# EAGLE design nixie_v5 (EAGLE 9.0.0)
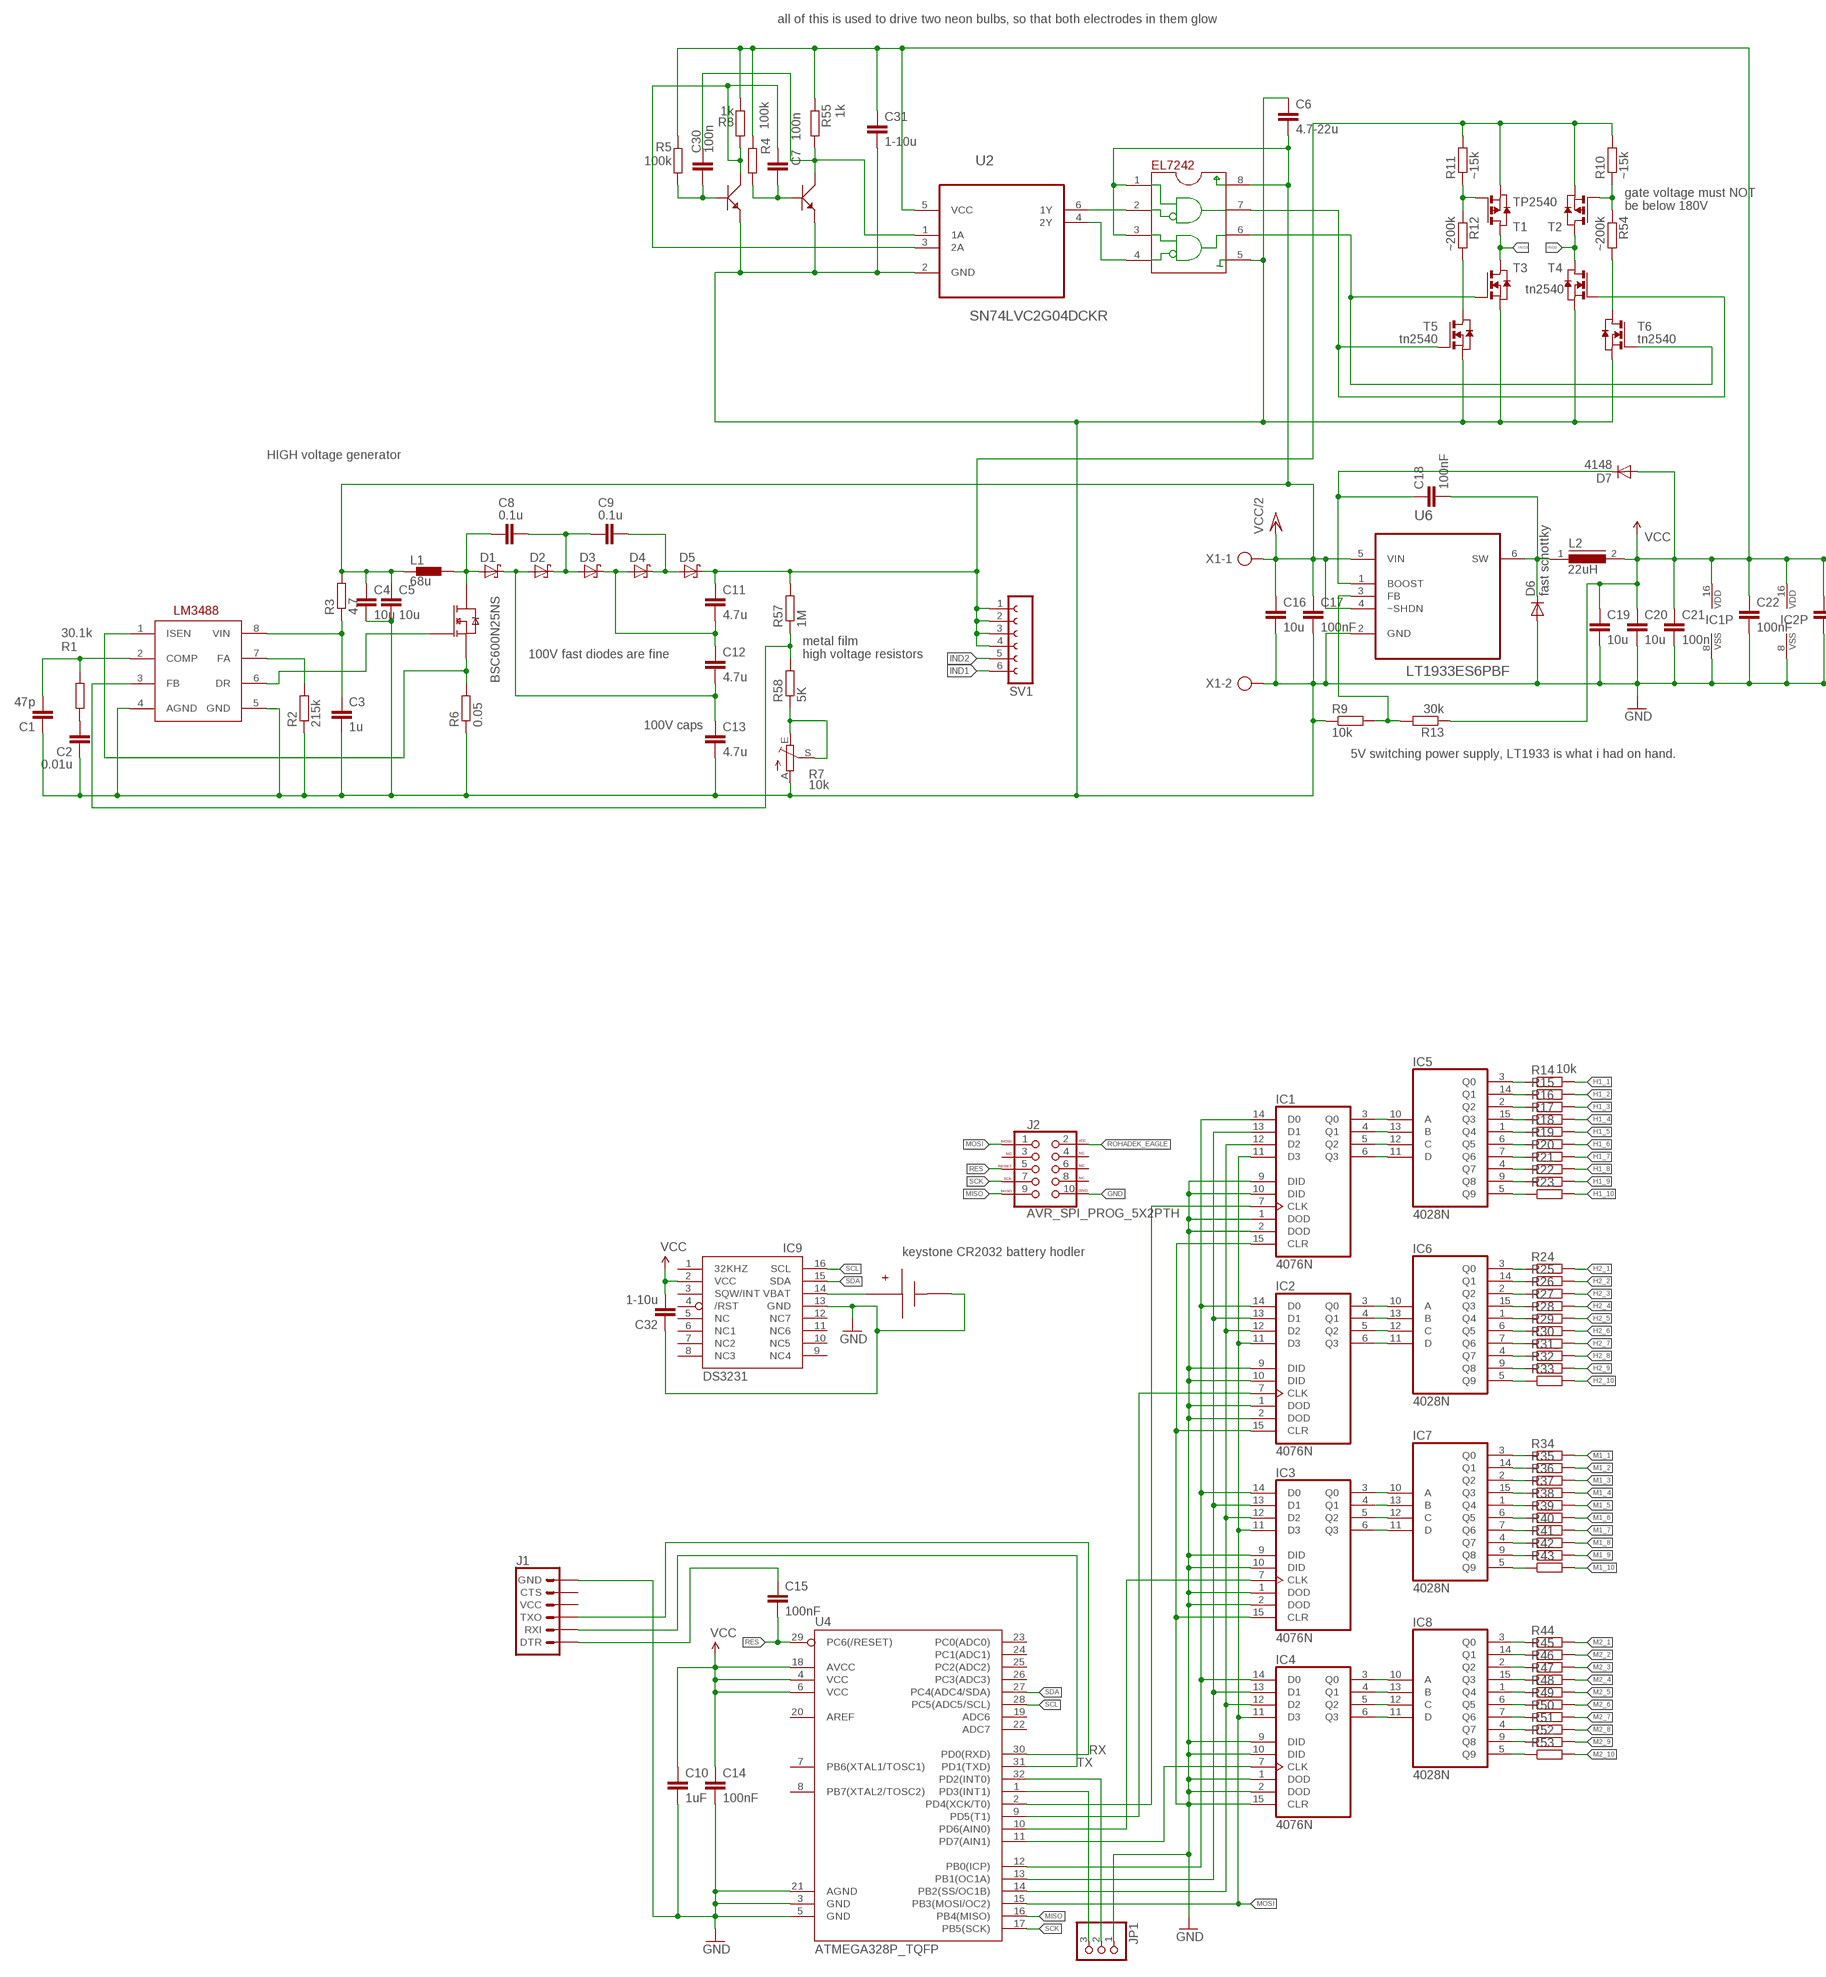
[diagram p0: schematic, sheet 1, part 1 of 2]
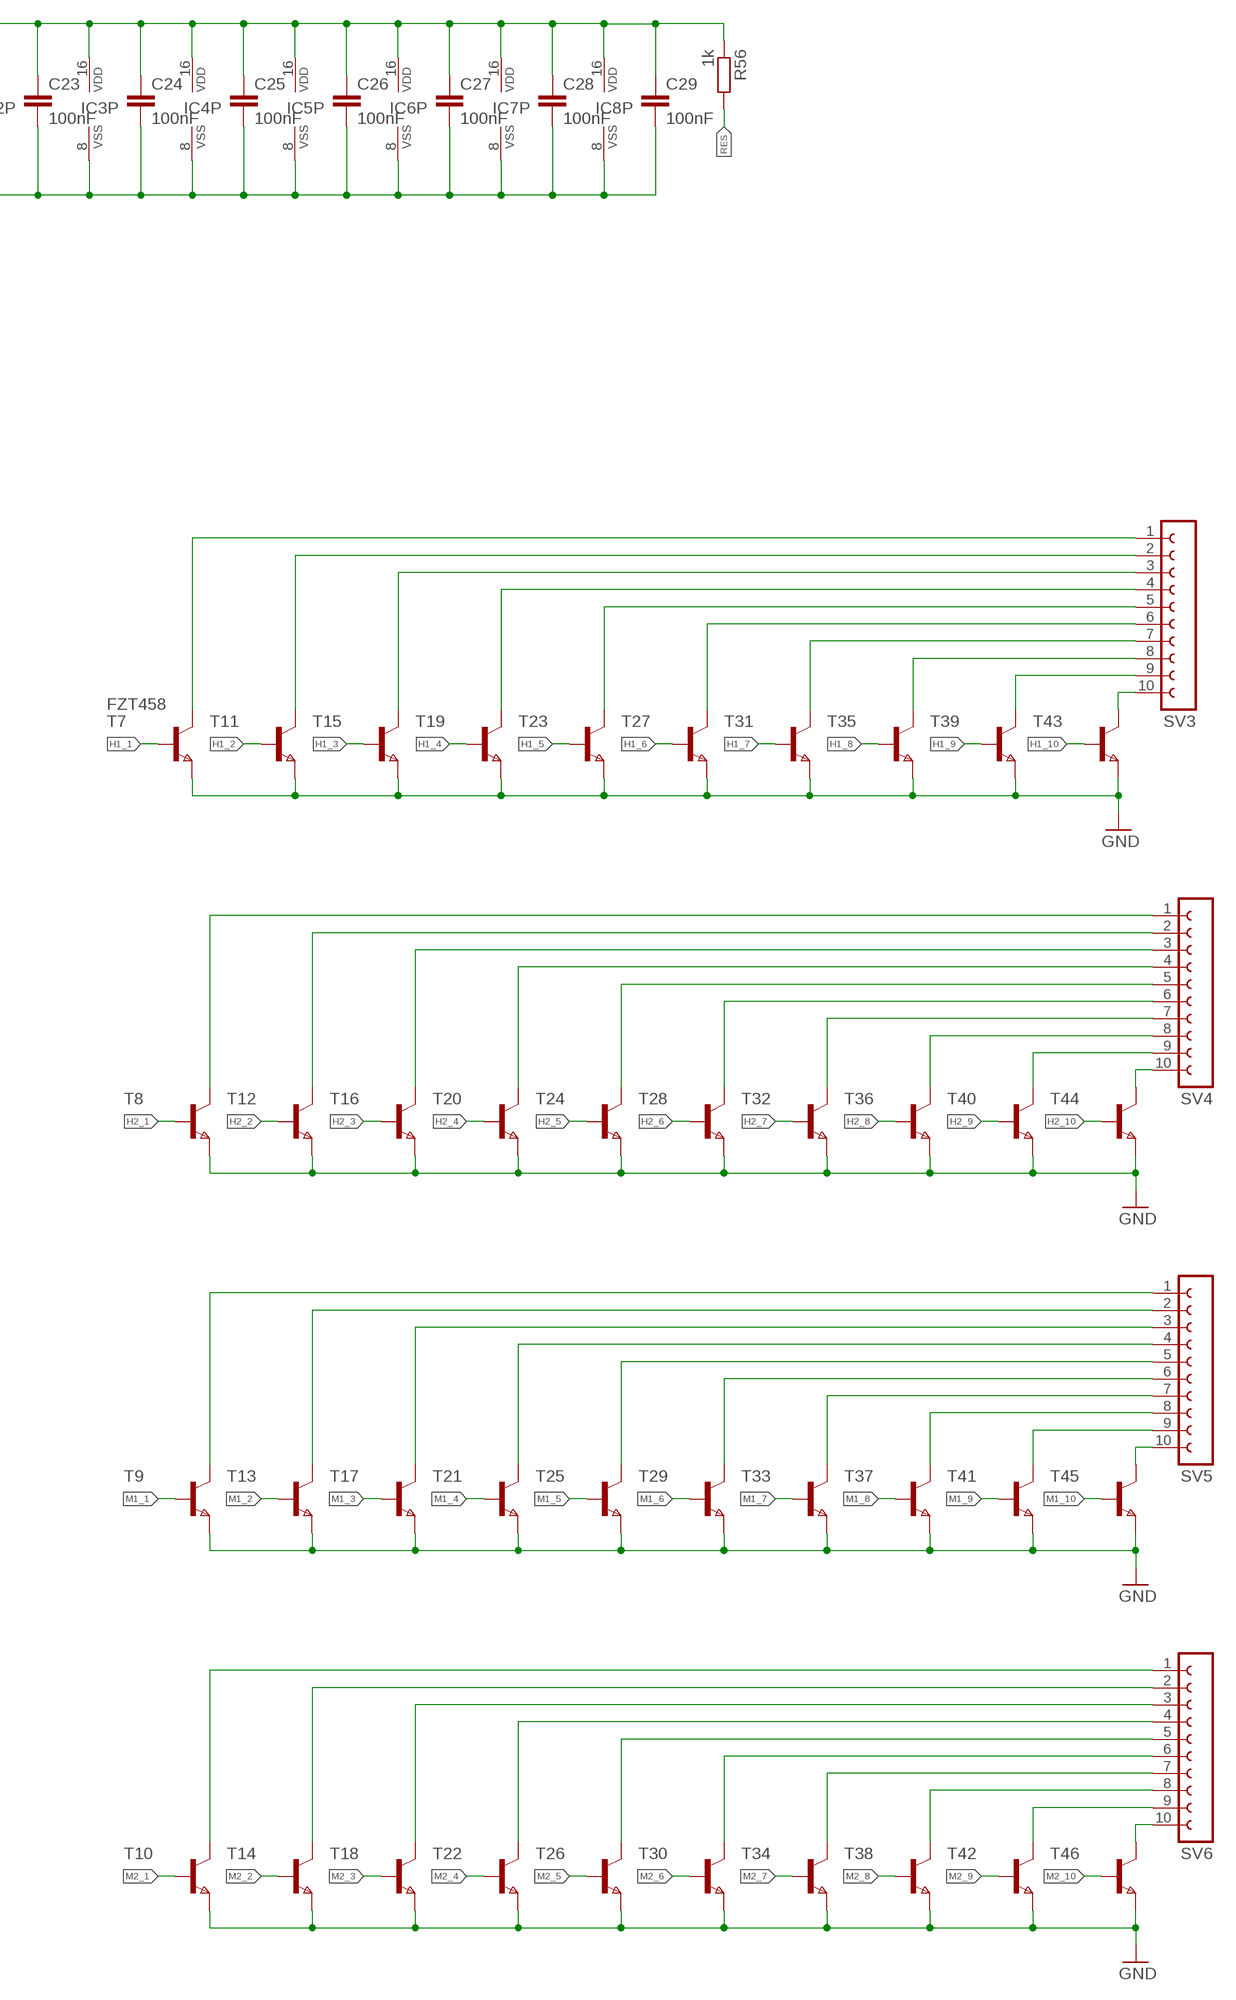
[diagram p1: schematic, sheet 1, part 2 of 2]

## Parts
BSC600N25NS  BSC600N25NS  PGTDSON  [PGTDSON]
C1  47p  C-EUC0402  [C0402]
C2  0.01u  C-EUC0402  [C0402]
C3  1u  C-EUC0805  [C0805]
C4  10u  C-EUC1206  [C1206]
C5  10u  C-EUC1206  [C1206]
C6  4.7-22u  C-EUC1206  [C1206]
C7  100n  C-EUC0402  [C0402]
C8  0.1u  C-EUC0805  [C0805]
C9  0.1u  C-EUC0805  [C0805]
C10  1uF  C-EUC0402  [C0402]
C11  4.7u  C-EUC2220K  [C2220K]
C12  4.7u  C-EUC2220K  [C2220K]
C13  4.7u  C-EUC2220K  [C2220K]
C14  100nF  C-EUC0402  [C0402]
C15  100nF  C-EUC0402  [C0402]
C16  10u  C-EUC1206  [C1206]
C17  100nF  C-EUC0805K  [C0805K]
C18  100nF  C-EUC0805K  [C0805K]
C19  10u  C-EUC1206  [C1206]
C20  10u  C-EUC1206  [C1206]
C21  100n  C-EUC0805K  [C0805K]
C22  100nF  C-EUC0805  [C0805]
C23  100nF  C-EUC0805  [C0805]
C24  100nF  C-EUC0805  [C0805]
C25  100nF  C-EUC0805  [C0805]
C26  100nF  C-EUC0805  [C0805]
C27  100nF  C-EUC0805  [C0805]
C28  100nF  C-EUC0805  [C0805]
C29  100nF  C-EUC0805  [C0805]
C30  100n  C-EUC0402  [C0402]
C31  1-10u  C-EUC0805  [C0805]
C32  1-10u  C-EUC0805  [C0805]
D1  SCHOTTKY-DIODE  [POWERDI123]
D2  SCHOTTKY-DIODE  [POWERDI123]
D3  SCHOTTKY-DIODE  [POWERDI123]
D4  SCHOTTKY-DIODE  [POWERDI123]
D5  SCHOTTKY-DIODE  [POWERDI123]
D6  fast schottky  DIODE-SOD123  [SOD123]
D7  4148  DIODE-SOD123  [SOD123]
EL7242  EL7242  [EL7242]
IC1  4076N  [DIL16]
IC2  4076N  [DIL16]
IC3  4076N  [DIL16]
IC4  4076N  [DIL16]
IC5  4028N  [DIL16]
IC6  4028N  [DIL16]
IC7  4028N  [DIL16]
IC8  4028N  [DIL16]
IC9  DS3231/SO  [SO16W]
J1  6_PIN_SERIAL_TARGETLOCK  [1X06_LOCK]
J2  AVR_SPI_PROG_5X2PTH  [2X5]
JP1  PINHD-1X3CB  [1X03-CLEANBIG]
L1  68u  DR1030  [DR1030]
L2  22uH  DR74  [DR74]
R1  30.1k  R-EU_R0402  [R0402]
R2  215k  R-EU_R0402  [R0402]
R3  4.7  R-EU_R0805  [R0805]
R4  100k  R-EU_R0402  [R0402]
R5  100k  R-EU_R0402  [R0402]
R6  0.05  R-EU_R2512  [R2512]
R7  10k  TRIM_EU-S64Y  [S64Y]
R8  1k  R-EU_R0402  [R0402]
R9  10k  R-EU_M0805  [M0805]
R10  ~15k  R-EU_M0805  [M0805]
R11  ~15k  R-EU_M0805  [M0805]
R12  ~200k  R-EU_M0805  [M0805]
R13  30k  R-EU_M0805  [M0805]
R14  10k  R-EU_M1206  [M1206]
R15  R-EU_M1206  [M1206]
R16  R-EU_M1206  [M1206]
R17  R-EU_M1206  [M1206]
R18  R-EU_M1206  [M1206]
R19  R-EU_M1206  [M1206]
R20  R-EU_M1206  [M1206]
R21  R-EU_M1206  [M1206]
R22  R-EU_M1206  [M1206]
R23  R-EU_M1206  [M1206]
R24  R-EU_M1206  [M1206]
R25  R-EU_M1206  [M1206]
R26  R-EU_M1206  [M1206]
R27  R-EU_M1206  [M1206]
R28  R-EU_M1206  [M1206]
R29  R-EU_M1206  [M1206]
R30  R-EU_M1206  [M1206]
R31  R-EU_M1206  [M1206]
R32  R-EU_M1206  [M1206]
R33  R-EU_M1206  [M1206]
R34  R-EU_M1206  [M1206]
R35  R-EU_M1206  [M1206]
R36  R-EU_M1206  [M1206]
R37  R-EU_M1206  [M1206]
R38  R-EU_M1206  [M1206]
R39  R-EU_M1206  [M1206]
R40  R-EU_M1206  [M1206]
R41  R-EU_M1206  [M1206]
R42  R-EU_M1206  [M1206]
R43  R-EU_M1206  [M1206]
R44  R-EU_M1206  [M1206]
R45  R-EU_M1206  [M1206]
R46  R-EU_M1206  [M1206]
R47  R-EU_M1206  [M1206]
R48  R-EU_M1206  [M1206]
R49  R-EU_M1206  [M1206]
R50  R-EU_M1206  [M1206]
R51  R-EU_M1206  [M1206]
R52  R-EU_M1206  [M1206]
R53  R-EU_M1206  [M1206]
R54  ~200k  R-EU_M0805  [M0805]
R55  1k  R-EU_R0402  [R0402]
R56  1k  R-EU_R0402  [R0402]
R57  1M  R-EU_R1206  [R1206]
R58  5K  R-EU_R1206  [R1206]
SV1  FE06-1  [FE06]
SV3  FE10-1  [FE10]
SV4  FE10-1  [FE10]
SV5  FE10-1  [FE10]
SV6  FE10-1  [FE10]
T1  TP2540  PMOSSOT89  [SOT89]
T2  tp2540  PMOSSOT89  [SOT89]
T3  tn2540  NMOSSOT89  [SOT89]
T4  tn2540  NMOSSOT89  [SOT89]
T5  tn2540  NMOSSOT89  [SOT89]
T6  tn2540  NMOSSOT89  [SOT89]
T7  FZT458  NPNSOT223  [SOT223]
T8  NPNSOT223  [SOT223]
T9  NPNSOT223  [SOT223]
T10  NPNSOT223  [SOT223]
T11  NPNSOT223  [SOT223]
T12  NPNSOT223  [SOT223]
T13  NPNSOT223  [SOT223]
T14  NPNSOT223  [SOT223]
T15  NPNSOT223  [SOT223]
T16  NPNSOT223  [SOT223]
T17  NPNSOT223  [SOT223]
T18  NPNSOT223  [SOT223]
T19  NPNSOT223  [SOT223]
T20  NPNSOT223  [SOT223]
T21  NPNSOT223  [SOT223]
T22  NPNSOT223  [SOT223]
T23  NPNSOT223  [SOT223]
T24  NPNSOT223  [SOT223]
T25  NPNSOT223  [SOT223]
T26  NPNSOT223  [SOT223]
T27  NPNSOT223  [SOT223]
T28  NPNSOT223  [SOT223]
T29  NPNSOT223  [SOT223]
T30  NPNSOT223  [SOT223]
T31  NPNSOT223  [SOT223]
T32  NPNSOT223  [SOT223]
T33  NPNSOT223  [SOT223]
T34  NPNSOT223  [SOT223]
T35  NPNSOT223  [SOT223]
T36  NPNSOT223  [SOT223]
T37  NPNSOT223  [SOT223]
T38  NPNSOT223  [SOT223]
T39  NPNSOT223  [SOT223]
T40  NPNSOT223  [SOT223]
T41  NPNSOT223  [SOT223]
T42  NPNSOT223  [SOT223]
T43  NPNSOT223  [SOT223]
T44  NPNSOT223  [SOT223]
T45  NPNSOT223  [SOT223]
T46  NPNSOT223  [SOT223]
U1  LM3488  [VSSOP-8]
U2  SN74LVC2G04DCKR  [SOT65P210X110-6N]
U4  ATMEGA328P_TQFP  [TQFP32-08]
U6  LT1933ES6PBF  [SOT95P280X145-6N]
U$1  RTC2032  [CR2032]
U$2  DUAL_NPNSC  [SC-70]
X1  AK300/2  [AK300/2]

## Nets
CLK_H1: IC1.7(CLK) U4.2(PD4(XCK/T0))
CLK_H2: IC2.7(CLK) U4.9(PD5(T1))
CLK_M1: IC3.7(CLK) U4.10(PD6(AIN0))
CLK_M2: IC4.7(CLK) U4.11(PD7(AIN1))
D0: IC1.14(D0) IC2.14(D0) IC3.14(D0) IC4.14(D0) U4.12(PB0(ICP))
D1: IC1.13(D1) IC2.13(D1) IC3.13(D1) IC4.13(D1) U4.13(PB1(OC1A))
D2: IC1.12(D2) IC2.12(D2) IC3.12(D2) IC4.12(D2) U4.14(PB2(SS/OC1B))
GND: C1.1 C2.2 C3.2 C4.2 C5.2 C6.1 C10.2 C13.2 C14.2 C16.2 C17.2 C19.2 C20.2 C21.2 C22.2 C23.2 C24.2 C25.2 C26.2 C27.2 C28.2 C29.2 C31.2 C32.1 D6.A EL7242.5 IC1.1(DOD) IC1.2(DOD) IC1.8(VSS) IC1.9(DID) IC1.10(DID) IC1.15(CLR) IC2.1(DOD) IC2.2(DOD) IC2.8(VSS) IC2.9(DID) IC2.10(DID) IC2.15(CLR) IC3.1(DOD) IC3.2(DOD) IC3.8(VSS) IC3.9(DID) IC3.10(DID) IC3.15(CLR) IC4.1(DOD) IC4.2(DOD) IC4.8(VSS) IC4.9(DID) IC4.10(DID) IC4.15(CLR) IC5.8(VSS) IC6.8(VSS) IC7.8(VSS) IC8.8(VSS) IC9.13(GND) J1.6(GND) J2.10(GND) JP1.1 R2.1 R6.1 R7.A R9.1 T3.3(S) T4.3(S) T5.3(S) T6.3(S) T7.3(E) T8.3(E) T9.3(E) T10.3(E) T11.3(E) T12.3(E) T13.3(E) T14.3(E) T15.3(E) T16.3(E) T17.3(E) T18.3(E) T19.3(E) T20.3(E) T21.3(E) T22.3(E) T23.3(E) T24.3(E) T25.3(E) T26.3(E) T27.3(E) T28.3(E) T29.3(E) T30.3(E) T31.3(E) T32.3(E) T33.3(E) T34.3(E) T35.3(E) T36.3(E) T37.3(E) T38.3(E) T39.3(E) T40.3(E) T41.3(E) T42.3(E) T43.3(E) T44.3(E) T45.3(E) T46.3(E) U1.4(AGND) U1.5(GND) U2.2(GND) U4.3(GND) U4.5(GND) U4.21(AGND) U6.2(GND) U$1.-(BATT-) U$2.1(EMITTER) U$2.4(EMITTER1) X1.2
H1_1: R14.2 T7.1(B)
H1_2: R15.2 T11.1(B)
H1_3: R16.2 T15.1(B)
H1_4: R17.2 T19.1(B)
H1_5: R18.2 T23.1(B)
H1_6: R19.2 T27.1(B)
H1_7: R20.2 T31.1(B)
H1_8: R21.2 T35.1(B)
H1_9: R22.2 T39.1(B)
H1_10: R23.2 T43.1(B)
H2_1: R24.2 T8.1(B)
H2_2: R25.2 T12.1(B)
H2_3: R26.2 T16.1(B)
H2_4: R27.2 T20.1(B)
H2_5: R28.2 T24.1(B)
H2_6: R29.2 T28.1(B)
H2_7: R30.2 T32.1(B)
H2_8: R31.2 T36.1(B)
H2_9: R32.2 T40.1(B)
H2_10: R33.2 T44.1(B)
INC: JP1.3 U4.1(PD3(INT1))
IND1: SV1.6 T1.2(D) T3.2(D) T3.2@1(D)
IND2: SV1.5 T2.2(D) T4.2(D) T4.2@1(D)
M1_1: R34.2 T9.1(B)
M1_2: R35.2 T13.1(B)
M1_3: R36.2 T17.1(B)
M1_4: R37.2 T21.1(B)
M1_5: R38.2 T25.1(B)
M1_6: R39.2 T29.1(B)
M1_7: R40.2 T33.1(B)
M1_8: R41.2 T37.1(B)
M1_9: R42.2 T41.1(B)
M1_10: R43.2 T45.1(B)
M2_1: R44.2 T10.1(B)
M2_2: R45.2 T14.1(B)
M2_3: R46.2 T18.1(B)
M2_4: R47.2 T22.1(B)
M2_5: R48.2 T26.1(B)
M2_6: R49.2 T30.1(B)
M2_7: R50.2 T34.1(B)
M2_8: R51.2 T38.1(B)
M2_9: R52.2 T42.1(B)
M2_10: R53.2 T46.1(B)
MISO: J2.9(MISO) U4.16(PB4(MISO))
MOSI: IC1.11(D3) IC2.11(D3) IC3.11(D3) IC4.11(D3) J2.1(MOSI) U4.15(PB3(MOSI/OC2))
N$1: IC9.14(VBAT) U$1.+(BATT+)
N$2: R11.1 R12.1 T1.1(G)
N$4: R7.E R7.S R58.1
N$9: IC1.3(Q0) IC5.10(A)
N$10: IC1.6(Q3) IC5.11(D)
N$11: IC1.5(Q2) IC5.12(C)
N$12: IC1.4(Q1) IC5.13(B)
N$13: IC2.3(Q0) IC6.10(A)
N$14: IC2.6(Q3) IC6.11(D)
N$15: IC2.5(Q2) IC6.12(C)
N$16: IC2.4(Q1) IC6.13(B)
N$17: IC3.3(Q0) IC7.10(A)
N$18: IC3.6(Q3) IC7.11(D)
N$19: IC3.5(Q2) IC7.12(C)
N$20: IC3.4(Q1) IC7.13(B)
N$21: IC4.3(Q0) IC8.10(A)
N$22: IC4.6(Q3) IC8.11(D)
N$23: IC4.5(Q2) IC8.12(C)
N$24: IC4.4(Q1) IC8.13(B)
N$25: SV3.1 T7.2(C) T7.4(C)
N$26: SV3.2 T11.2(C) T11.4(C)
N$27: C18.1 D7.C U6.1(BOOST)
N$28: SV3.3 T15.2(C) T15.4(C)
N$29: SV3.4 T19.2(C) T19.4(C)
N$30: SV3.5 T23.2(C) T23.4(C)
N$31: SV3.6 T27.2(C) T27.4(C)
N$32: SV3.7 T31.2(C) T31.4(C)
N$33: SV3.8 T35.2(C) T35.4(C)
N$34: SV3.9 T39.2(C) T39.4(C)
N$35: SV3.10 T43.2(C) T43.4(C)
N$36: C3.1 R3.1 U1.8(VIN)
N$37: IC5.3(Q0) R14.1
N$38: IC5.14(Q1) R15.1
N$39: IC5.2(Q2) R16.1
N$40: IC5.15(Q3) R17.1
N$41: IC5.1(Q4) R18.1
N$42: IC5.6(Q5) R19.1
N$43: IC5.7(Q6) R20.1
N$44: IC5.4(Q7) R21.1
N$45: IC5.9(Q8) R22.1
N$46: IC5.5(Q9) R23.1
N$47: IC6.3(Q0) R24.1
N$48: IC6.14(Q1) R25.1
N$49: IC6.2(Q2) R26.1
N$50: IC6.15(Q3) R27.1
N$51: IC6.1(Q4) R28.1
N$52: IC6.6(Q5) R29.1
N$53: IC6.7(Q6) R30.1
N$54: IC6.4(Q7) R31.1
N$55: IC6.9(Q8) R32.1
N$56: IC6.5(Q9) R33.1
N$57: SV4.1 T8.2(C) T8.4(C)
N$58: SV4.2 T12.2(C) T12.4(C)
N$59: SV4.3 T16.2(C) T16.4(C)
N$60: SV4.4 T20.2(C) T20.4(C)
N$61: SV4.5 T24.2(C) T24.4(C)
N$62: SV4.6 T28.2(C) T28.4(C)
N$63: SV4.7 T32.2(C) T32.4(C)
N$64: SV4.8 T36.2(C) T36.4(C)
N$65: SV4.9 T40.2(C) T40.4(C)
N$66: SV4.10 T44.2(C) T44.4(C)
N$67: IC8.3(Q0) R44.1
N$68: IC8.14(Q1) R45.1
N$69: IC8.2(Q2) R46.1
N$70: IC8.15(Q3) R47.1
N$71: IC8.1(Q4) R48.1
N$72: IC8.6(Q5) R49.1
N$73: IC8.7(Q6) R50.1
N$74: IC8.4(Q7) R51.1
N$75: IC8.9(Q8) R52.1
N$76: IC8.5(Q9) R53.1
N$77: IC7.3(Q0) R34.1
N$78: IC7.14(Q1) R35.1
N$79: IC7.2(Q2) R36.1
N$80: IC7.15(Q3) R37.1
N$81: IC7.1(Q4) R38.1
N$82: IC7.6(Q5) R39.1
N$83: IC7.7(Q6) R40.1
N$84: IC7.4(Q7) R41.1
N$85: IC7.9(Q8) R42.1
N$86: IC7.5(Q9) R43.1
N$89: R9.2 R13.2 U6.3(FB)
N$90: BSC600N25NS.DRAIN C8.2 D1.A L1.2
N$91: R2.2 U1.7(FA)
N$92: BSC600N25NS.GATE U1.6(DR)
N$93: BSC600N25NS.SOURCE BSC600N25NS.SOURCE1(SOURCE) BSC600N25NS.SOURCE3(SOURCE) R6.2 U1.1(ISEN)
N$94: C8.1 C9.2 D2.K(C) D3.A
N$95: C9.1 D4.K(C) D5.A
N$96: C12.2 C13.1 D1.K(C) D2.A
N$97: SV5.1 T9.2(C) T9.4(C)
N$98: SV5.2 T13.2(C) T13.4(C)
N$99: SV5.3 T17.2(C) T17.4(C)
N$100: SV5.4 T21.2(C) T21.4(C)
N$101: SV5.5 T25.2(C) T25.4(C)
N$102: SV5.6 T29.2(C) T29.4(C)
N$103: SV5.7 T33.2(C) T33.4(C)
N$104: SV5.8 T37.2(C) T37.4(C)
N$105: SV5.9 T41.2(C) T41.4(C)
N$106: SV5.10 T45.2(C) T45.4(C)
N$107: SV6.1 T10.2(C) T10.4(C)
N$108: SV6.2 T14.2(C) T14.4(C)
N$109: SV6.3 T18.2(C) T18.4(C)
N$110: SV6.4 T22.2(C) T22.4(C)
N$111: SV6.5 T26.2(C) T26.4(C)
N$112: SV6.6 T30.2(C) T30.4(C)
N$113: SV6.7 T34.2(C) T34.4(C)
N$114: SV6.8 T38.2(C) T38.4(C)
N$115: SV6.9 T42.2(C) T42.4(C)
N$116: SV6.10 T46.2(C) T46.4(C)
N$118: C11.2 C12.1 D3.K(C) D4.A
N$120: C1.2 R1.2 U1.2(COMP)
N$121: R57.1 R58.2 U1.3(FB)
N$123: C2.1 R1.1
N$125: C15.1 J1.1(DTR)
N$136: R10.1 R54.1 T2.1(G)
N$137: EL7242.6 T3.1(G) T6.1(G)
N$138: C30.2 R5.2 U$2.2(BASE)
N$139: C7.2 R4.2 U$2.5(BASE1)
N$140: C7.1 R8.2 U2.3(2A) U$2.6(COLLECTOR)
N$141: R12.2 T5.2(D) T5.2@1(D)
N$142: R54.2 T6.2(D) T6.2@1(D)
N$143: C30.1 R55.2 U2.1(1A) U$2.3(COLLECTOR1)
N$145: EL7242.7 T4.1(G) T5.1(G)
N$148: C11.1 D5.K(C) R10.2 R11.2 R57.2 SV1.1 SV1.2 SV1.3 SV1.4 T1.3(S) T2.3(S)
N$150: EL7242.2 U2.6(1Y)
N$151: EL7242.4 U2.4(2Y)
RES: C15.2 J2.5(RESET) R56.2 U4.29(PC6(/RESET))
ROHADEK_EAGLE: J2.2(VCC)
RX: J1.3(TXO) U4.30(PD0(RXD))
SCK: J2.7(SCK) U4.17(PB5(SCK))
SCL: IC9.16(SCL) U4.28(PC5(ADC5/SCL))
SDA: IC9.15(SDA) U4.27(PC4(ADC4/SDA))
SET: JP1.2 U4.32(PD2(INT0))
SW: C18.2 D6.C L2.1 U6.6(SW)
TX: J1.2(RXI) U4.31(PD1(TXD))
VCC: C10.1 C14.1 C19.1 C20.1 C21.1 C22.1 C23.1 C24.1 C25.1 C26.1 C27.1 C28.1 C29.1 C31.1 C32.2 D7.A IC1.16(VDD) IC2.16(VDD) IC3.16(VDD) IC4.16(VDD) IC5.16(VDD) IC6.16(VDD) IC7.16(VDD) IC8.16(VDD) IC9.2(VCC) L2.2 R4.1 R5.1 R8.1 R13.1 R55.1 R56.1 U2.5(VCC) U4.4(VCC) U4.6(VCC) U4.18(AVCC)
VCC/2: C4.1 C5.1 C6.2 C16.1 C17.1 EL7242.1 EL7242.3 EL7242.8 L1.1 R3.2 U6.4(~SHDN) U6.5(VIN) X1.1
Unconnected: IC9.1(32KHZ) IC9.3(SQW/INT) IC9.4(/RST) IC9.5(NC) IC9.6(NC1) IC9.7(NC2) IC9.8(NC3) IC9.9(NC4) IC9.10(NC5) IC9.11(NC6) IC9.12(NC7) J1.4(VCC) J1.5(CTS) J2.3(NC) U4.7(PB6(XTAL1/TOSC1)) U4.8(PB7(XTAL2/TOSC2)) U4.19(ADC6) U4.20(AREF) U4.22(ADC7) U4.23(PC0(ADC0)) U4.24(PC1(ADC1)) U4.25(PC2(ADC2)) U4.26(PC3(ADC3))

## Notes on the sheet
- all of this is used to drive two neon bulbs, so that both electrodes in them glow
- gate voltage must NOT 
  be below 180V
- HIGH voltage generator
- BSC600N25NS
- 100V fast diodes are fine
- metal film 
  high voltage resistors
- 100V caps
- 5V switching power supply, LT1933 is what i had on hand.
- keystone CR2032 battery hodler

## Power pins joined to a net without a drawn wire
NC: J2.4(NC) J2.6(NC) J2.8(NC)

## Library data of the parts
BSC600N25NS = PG-TDSON-8:PGTDSON: 600N25NS3G N-channel PG-TDSON-8 250V
C1-C29 = rcl:C-EU: CAPACITOR, European symbol
C30-C32 = rcl:C-EU: CAPACITOR, European symbol; SPICEPREFIX: C
D1-D5 = diode:SCHOTTKY-DIODE: Schottky Diode
D6 D7 = diode:DIODE-: DIODE
EL7242 = EL7242:EL7242: élantec EL7242 MOSFET driver 10Mhz 3V 5V input compatible 20ns delay time 2A peak drive VCC= 4.5V-16V SOIC Pcase 570mW
IC1-IC4 = 40xx:4076: Quad D-type REGISTER
IC5-IC8 = 40xx:4028: BCD to decimal DECODER
IC9 = adafruit:DS3231
J1 = SparkFun-Connectors:6_PIN_SERIAL_TARGET: 6-pin header connection for use with the "FTDI BASIC" pinout - TARGET SIDE. Also known as "Arduino Serial Program Header". It is used to mate with our FTDI Basic serial programmers using the Arduino IDE. Note, this device has "TARGET" in the name. It is intended to be used on a design that contains a target micro-controller that you wish to program. The "sister" device, named "CABLE" is inteneded to be used on a design that usually lives on the end of your USB cable and prvides the converter chip (FTDI232 or FTDI231x) to commnicate serial RX/TX. You can populate with some of these: Break Away Headers - Straight <https://www.sparkfun.com/products/116> (PRT-00116) For reference (or to suit your programming needs) check out these designs: SparkFun FTDI Basic Breakout - 5V <https://www.sparkfun.com/products/9716> (DEV-09716) SparkFun FTDI Basic Breakout - 3.3V <https://www.sparkfun.com/products/9873> (DEV-09873) SparkFun FTDI SmartBasic <https://www.sparkfun.com/products/12935> (DEV-12935) SparkFun Beefy 3 - FTDI Basic Breakout <https://www.sparkfun.com/products/13746> (DEV-13746)
J2 = SparkFun-Connectors:AVR_SPI_PROG_5X2: AVR 10-pin ICSP Header This is the standard AVR In Circuit Serial Programming header. Minimal, but includes pin one indicator. Works with standard Olimex programmers. SparkFun Products: 2x5 AVR ICSP Male Header <https://www.sparkfun.com/products/778> - PTH 2x5 Pin Shrouded Header <https://www.sparkfun.com/products/8506> - PTH2
JP1 = adafruit:PINHD-1X3: PIN HEADER
L1 = inductors:DR1030: DR1030 Series Low Profile Power Inductors Source: Data sheet <http://www.cooperbussmann.com/pdf/c73e479f-f867-4c64-ae26-9c1f23814163.pdf>
L2 = inductors:DR74: High Power Density, High Efficiency, Shielded Inductors Source: coiltronics_dr_series.pdf
R1-R3 R6 R10-R12 R14-R54 R56-R58 = rcl:R-EU_: RESISTOR, European symbol
R4 R5 R8 R55 = rcl:R-EU_: RESISTOR, European symbol; SPICEPREFIX: R
R7 = pot:TRIM_EU-: POTENTIOMETER
R9 R13 = resistor:R-EU_: RESISTOR, European symbol
SV1 = con-lsta:FE06-1: FEMALE HEADER; OC_FARNELL: unknown; OC_NEWARK: unknown
SV3-SV6 = con-lsta:FE10-1: FEMALE HEADER; OC_FARNELL: unknown; OC_NEWARK: unknown
T1 T2 = zetex:PMOSSOT89: MOS FET; OC_FARNELL: unknown; OC_NEWARK: unknown
T3-T6 = zetex:NMOSSOT89: MOS FET; OC_FARNELL: unknown; OC_NEWARK: unknown
T7-T46 = zetex:NPNSOT223: NPN TRANSISTOR; MPN: DJT4031N-13; OC_FARNELL: 1710672; OC_NEWARK: 25R4490
U1 = texas:LM3488: LM3488 DC-DC converter
U2 = Texas Instruments_By_element14_Batch_1:SN74LVC2G04DCKR: DUAL INVERTER GATE; MPN: SN74LVC2G04DCKR; OC_FARNELL: 1470882; OC_NEWARK: 76C4192; PACKAGE: SC70-6; SUPPLIER: Texas Instruments
U4 = SparkFun-IC-Microcontroller:ATMEGA328P_TQFP: Popular 328P in QFP Storefront component: ATmega328 - TQFP <https://www.sparkfun.com/products/13448> (COM-13448) Datasheet <http://www.sparkfun.com/datasheets/Components/SMD/ATMega328.pdf> SparkFun Products SparkFun RedBoard - Programmed with Arduino <https://www.sparkfun.com/products/12757> (DEV-12757) Arduino Pro Mini 328 - 5V/16MHz <https://www.sparkfun.com/products/11113> (DEV-11113) Arduino Pro Mini 328 - 3.3V/8MHz <https://www.sparkfun.com/products/11114> (DEV-11114) SparkFun OpenLog <https://www.sparkfun.com/products/13712> (DEV-13712) SparkFun MicroView - OLED Arduino Module <https://www.sparkfun.com/products/12923> (DEV-12923) SparkFun Digital Sandbox <https://www.sparkfun.com/products/12651> (DEV-12651) SparkFun PicoBoard <https://www.sparkfun.com/products/11888> (WIG-11888) Arduino Fio <https://www.sparkfun.com/products/10116> (DEV-10116) LilyPad Arduino 328 Main Board <https://www.sparkfun.com/products/13342> (DEV-13342) SparkFun RedStick <https://www.sparkfun.com/products/13741> (DEV-13741) LilyPad MP3 <https://www.sparkfun.com/products/11013> (DEV-11013) LilyPad Arduino SimpleSnap <https://www.sparkfun.com/products/10941> (DEV-10941) SparkFun Stepoko <https://www.sparkfun.com/products/13899> (ROB-13899) SparkFun Geiger Counter <https://www.sparkfun.com/products/11345> (SEN-11345) SparkFun EL Sequencer <https://www.sparkfun.com/products/12781> (COM-12781) Arduino Pro 328 - 5V/16MHz <https://www.sparkfun.com/products/10915> (DEV-10915) CryptoCape <https://www.sparkfun.com/products/12773> (DEV-12773) SparkFun IR Thermometer Evaluation Board - MLX90614 <https://www.sparkfun.com/products/10740> (SEN-10740) SparkFun RedBot Mainboard <https://www.sparkfun.com/products/12097> (ROB-12097) Arduino Pro 328 - 3.3V/8MHz <https://www.sparkfun.com/products/10914> (DEV-10914) SparkFun Block for Intel® Edison - Arduino <https://www.sparkfun.com/products/13036> (DEV-13036) SparkFun Simon Says - Surface Mount Soldering Kit <https://www.sparkfun.com/products/10935> (KIT-10935) SparkFun 7-Segment Serial Display - Red <https://www.sparkfun.com/products/11441> (COM-11441) SparkFun 7-Segment Serial Display - White <https://www.sparkfun.com/products/11629> (COM-11629) SparkFun 7-Segment Serial Display - Yellow <https://www.sparkfun.com/products/11443> (COM-11443) SparkFun 7-Segment Serial Display - Kelly Green <https://www.sparkfun.com/products/11440> (COM-11440) SparkFun 7-Segment Serial Display - Blue <https://www.sparkfun.com/products/11442> (COM-11442) SparkFun OpenSegment Serial Display - 20mm (Blue) <https://www.sparkfun.com/products/11647> (COM-11647) SparkFun OpenSegment Serial Display - 20mm (Green) <https://www.sparkfun.com/products/11646> (COM-11646) SparkFun OpenSegment Serial Display - 20mm (White) <https://www.sparkfun.com/products/11648> (COM-11648) SparkFun OpenSegment Serial Display - 20mm (Red) <https://www.sparkfun.com/products/11644> (COM-11644) SparkFun OpenSegment Serial Display - 20mm (Yellow) <https://www.sparkfun.com/products/11645> (COM-11645) SparkFun OpenSegment Shield <https://www.sparkfun.com/products/13190> (DEV-13190); PROD_ID: IC-09069
U6 = LTC_By_element14_Batch_1:LT1933ES6PBF: Step-Down Switching Regulator; MPN: LT1933ES6#PBF; OC_FARNELL: 1531508; OC_NEWARK: 61M3373; PACKAGE: SOT-23-6; SUPPLIER: Linear Technology
U$1 = keystone 500:RTC: coin cell battery holder
U$2 = SparkFun-Retired:DUAL_NPN: dual npn transistor SOT 363 SC 70
X1 = con-ptr500:AK300/2: CONNECTOR; OC_FARNELL: unknown; OC_NEWARK: unknown

## Board
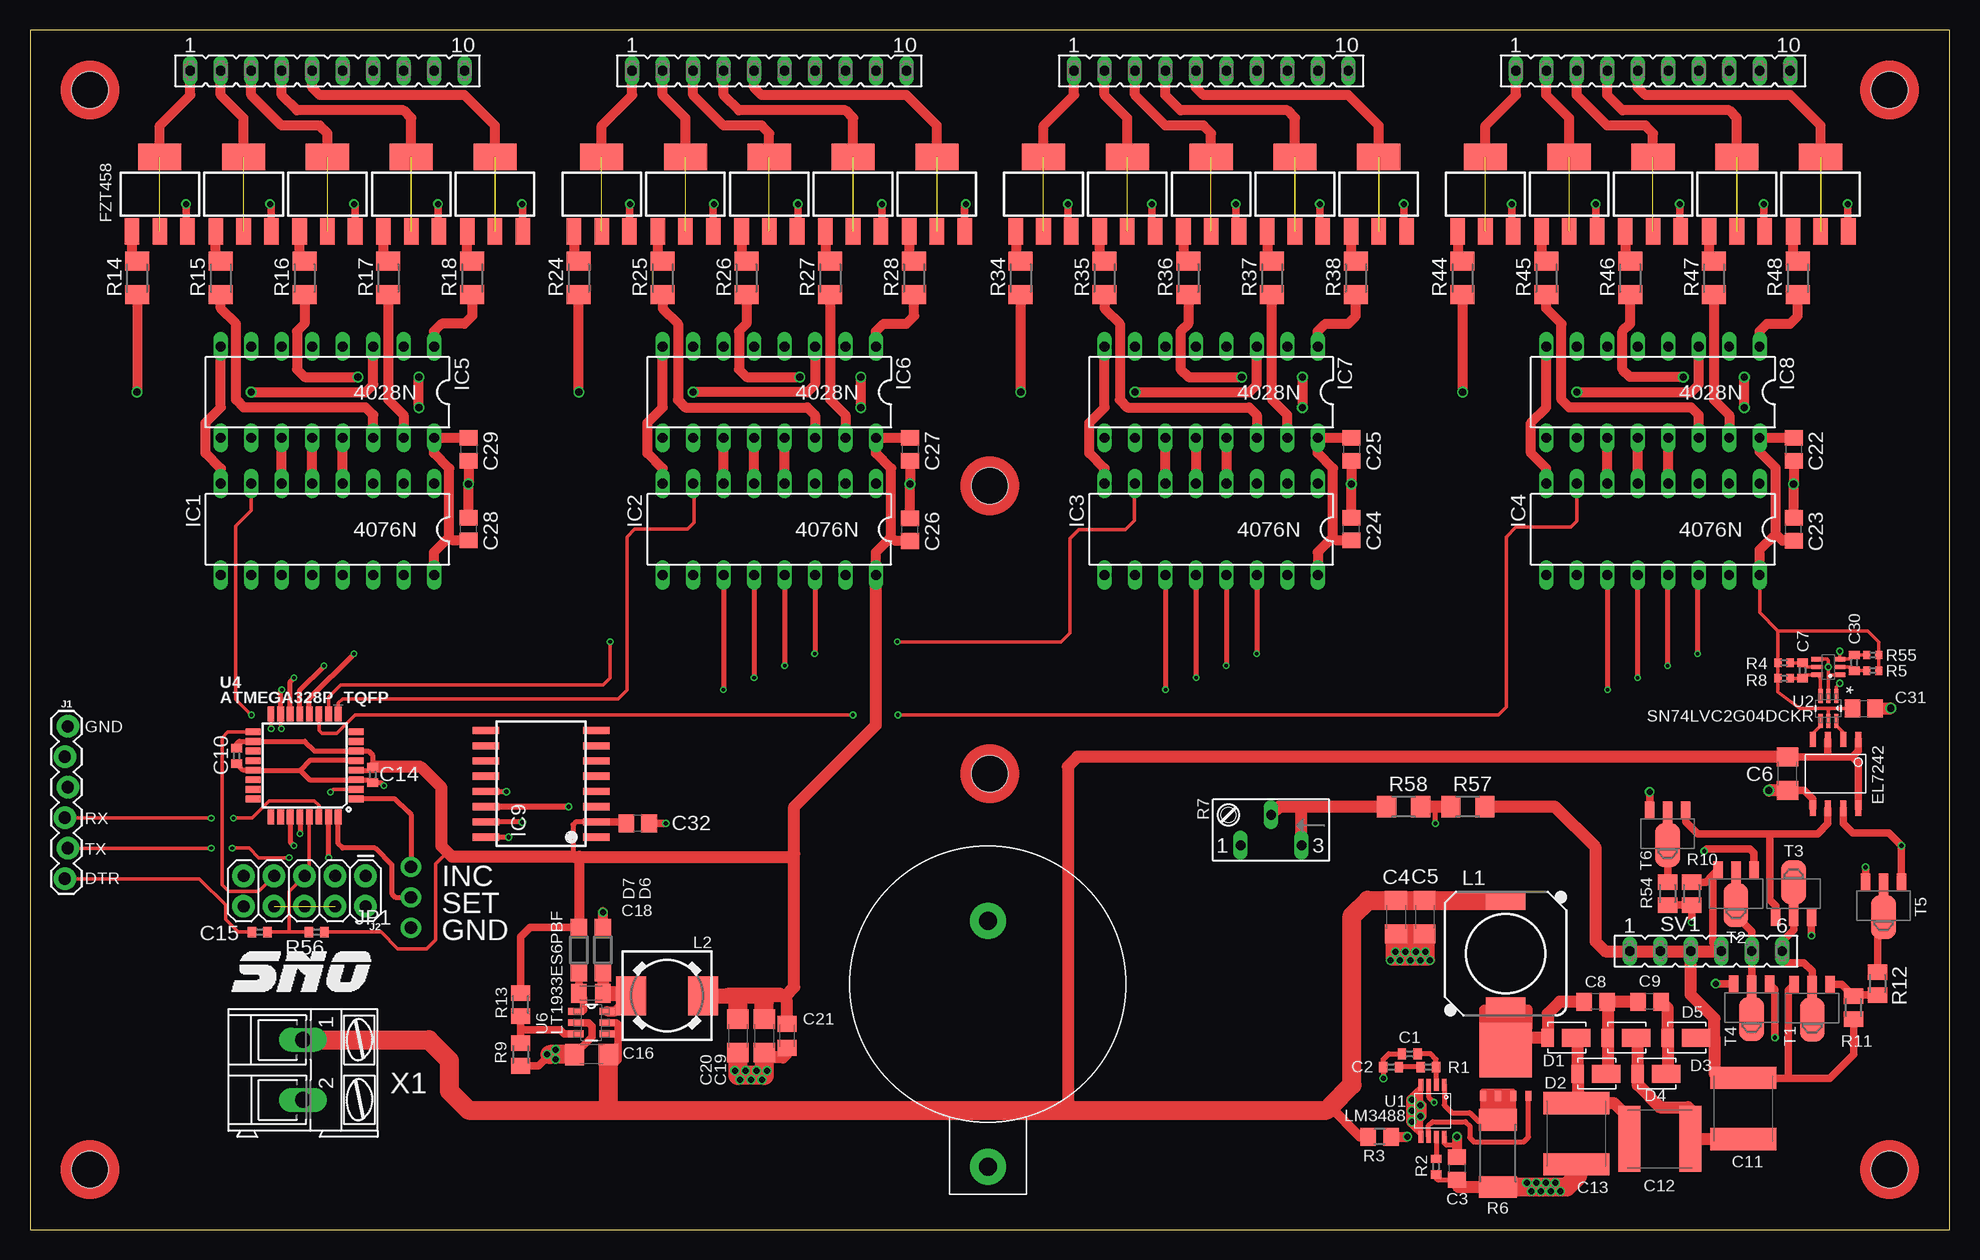
[diagram p2: board, top side]
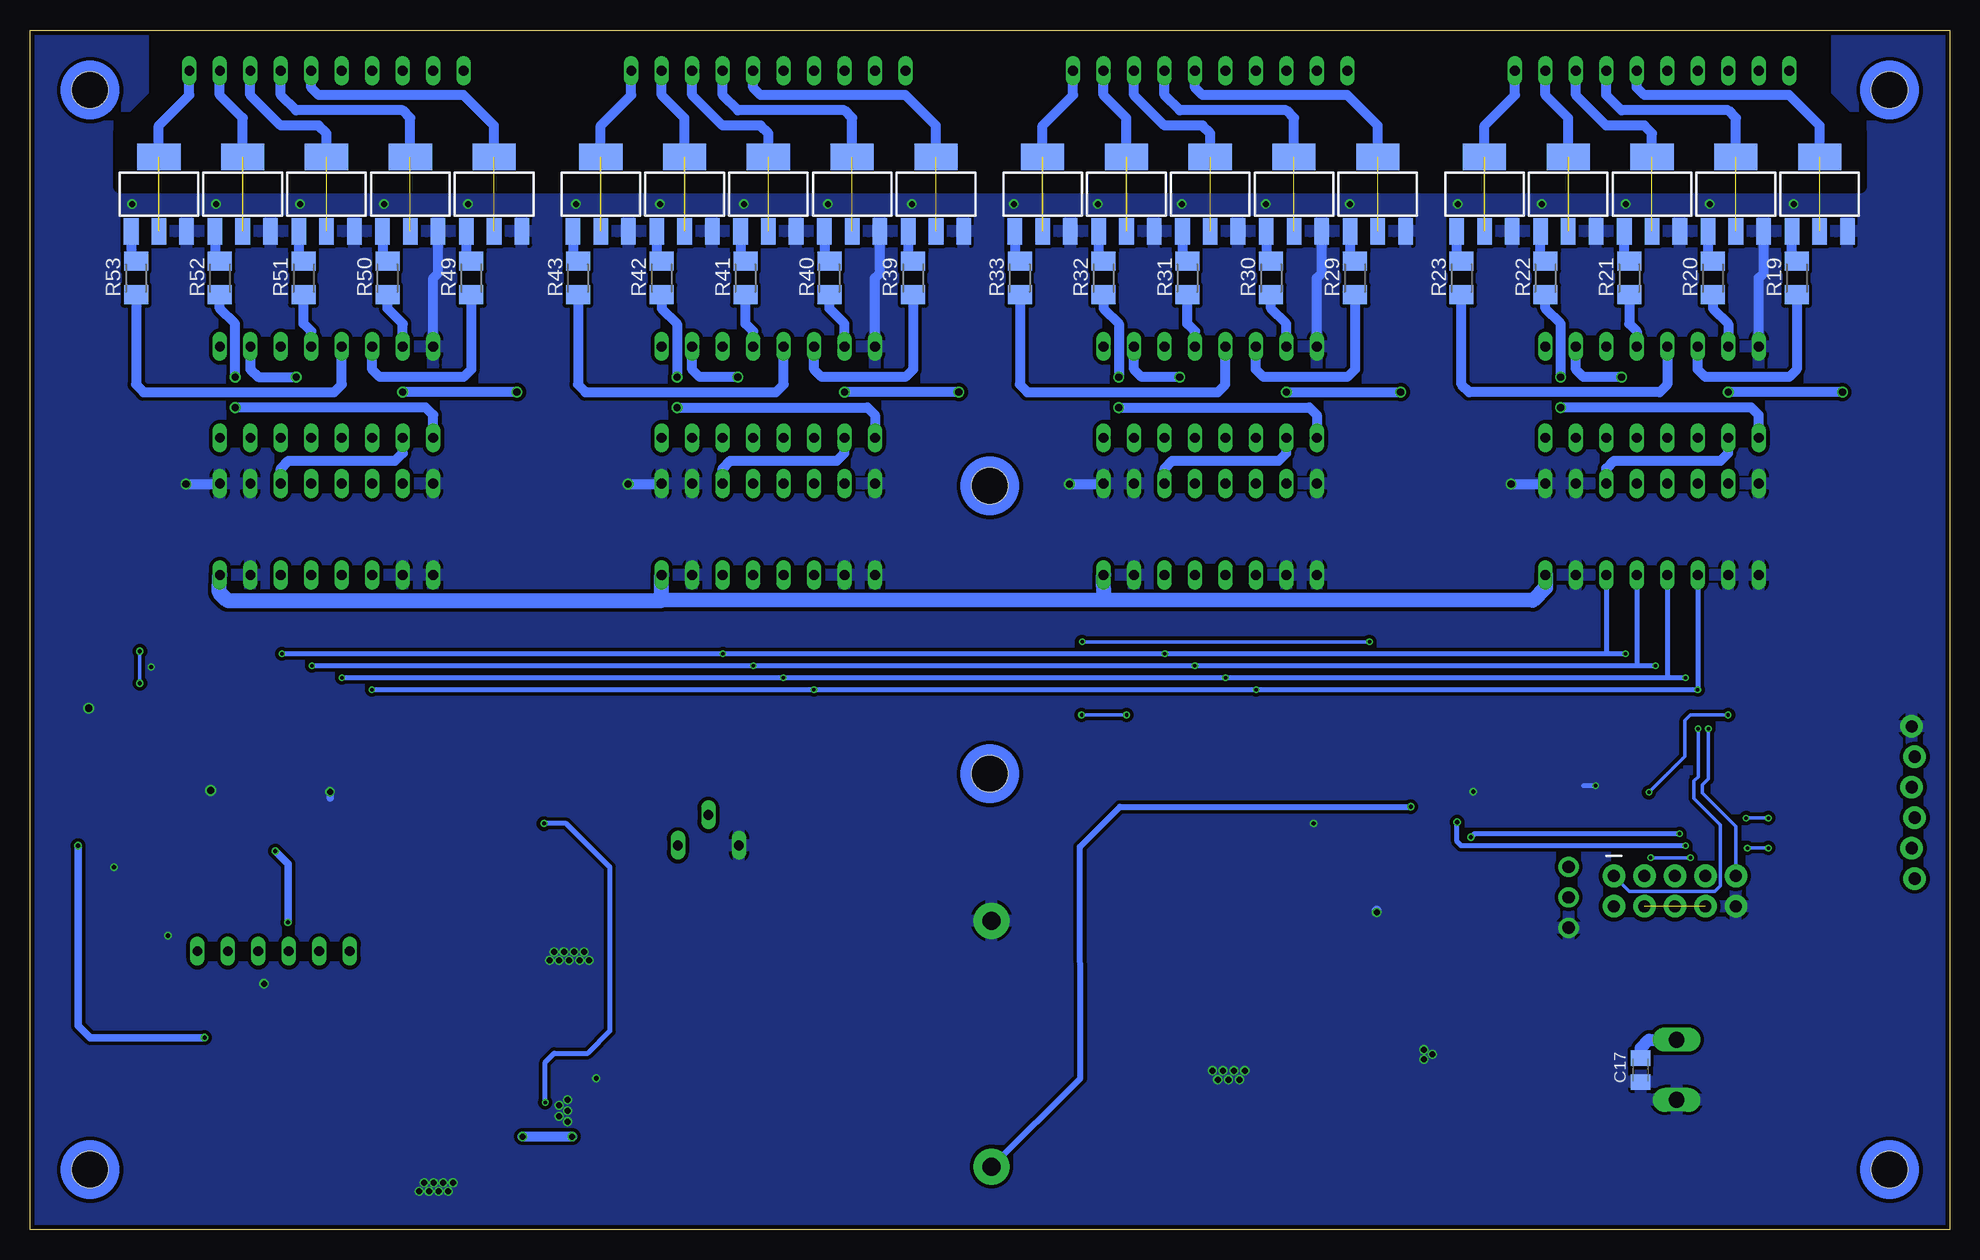
[diagram p3: board, bottom side, seen from below]

Size 160 x 100 mm. Coordinates in mm from the lower left corner, seen from the top.
Outline: 0,0 160,0 160,100 0,100 0,0
Copper layers (1*16): Top 0.035559375mm / dielectric 1.6mm / Bottom 0.035559375mm
Design rules "oshpark-2layer *": minimum track width 6mil, minimum drill 10mil, track to track 6mil, track to pad 6mil, pad to pad 6mil, via to via 6mil, smd to smd 6mil, copper to edge 15mil, drill to drill 6mil, minimum pad ring 5mil, minimum via ring 5mil, stop-mask expansion 2.5mil, vias tented up to drill 40mil, thermal gap 10mil
Holes 3 mm at 155,5 5,5 5,95 155,95 80,62 80,38
bRestrict: 8 lines

### Footprints (pad centres in the part's own frame; a part is rotated, then mirrored left to right if it is on the bottom)
PGTDSON = smd 4.41 x 4.55: DRAIN 0,0.953 | smd 0.5 x 0.85: GATE 1.905,-2.857; SOURCE -1.905,-2.857; SOURCE1 -0.635,-2.857; SOURCE3 0.635,-2.857
C0402 = smd 0.7 x 0.9: 1 -0.65,0; 2 0.65,0
C0805 = smd 1.3 x 1.5: 1 -0.95,0; 2 0.95,0
C1206 = smd 1.6 x 1.8: 1 -1.4,0; 2 1.4,0
C2220K = smd 1.85 x 5.5: 1 -2.55,0; 2 2.55,0
C0805K = smd 1.3 x 1.6: 1 -1,0; 2 1,0
POWERDI123 = smd 1.05 x 1.5: A 0,0 | smd 2.4 x 1.5: K 2.375,0
SOD123 = smd 1.4 x 1.4: A 1.9,0; C -1.9,0
EL7242 = smd 0.508 x 1.27: 1 -1.905,-2.857; 2 -0.635,-2.857; 3 0.635,-2.857; 4 1.905,-2.857; 5 1.905,2.883; 6 0.635,2.883; 7 -0.635,2.883; 8 -1.905,2.883
DIL16 = drill 0.813 long: 1 -8.89,-3.81; 2 -6.35,-3.81; 3 -3.81,-3.81; 4 -1.27,-3.81; 5 1.27,-3.81; 6 3.81,-3.81; 7 6.35,-3.81; 8 8.89,-3.81; 9 8.89,3.81; 10 6.35,3.81; 11 3.81,3.81; 12 1.27,3.81; 13 -1.27,3.81; 14 -3.81,3.81; 15 -6.35,3.81; 16 -8.89,3.81
SO16W = smd 0.6 x 2.2: 1 -4.445,-4.6; 2 -3.175,-4.6; 3 -1.905,-4.6; 4 -0.635,-4.6; 5 0.635,-4.6; 6 1.905,-4.6; 7 3.175,-4.6; 8 4.445,-4.6; 9 4.445,4.6; 10 3.175,4.6; 11 1.905,4.6; 12 0.635,4.6; 13 -0.635,4.6; 14 -1.905,4.6; 15 -3.175,4.6; 16 -4.445,4.6
1X06_LOCK = drill 1.016 pad 1.88: 1 0,0; 2 2.54,-0.254; 3 5.08,0; 4 7.62,-0.254; 5 10.16,0; 6 12.7,-0.254
2X5 = drill 1.016 pad 1.88: 1 0,0; 2 0,2.54; 3 2.54,0; 4 2.54,2.54; 5 5.08,0; 6 5.08,2.54; 7 7.62,0; 8 7.62,2.54; 9 10.16,0; 10 10.16,2.54
1X03-CLEANBIG = drill 1.016 pad 1.676: 1 -2.54,0; 2 0,0; 3 2.54,0
DR1030 = smd 3.3 x 1.6: 1 0,4.45; 2 0,-4.45
DR74 = smd 2.5 x 3.25: 1 -3,0; 2 3,0
R0402 = smd 0.7 x 0.9: 1 -0.65,0; 2 0.65,0
R0805 = smd 1.3 x 1.5: 1 -0.95,0; 2 0.95,0
R0402' = smd 0.6 x 0.7: 1 -0.5,0; 2 0.5,0
R2512 = smd 1.8 x 3.2: 1 -2.8,0; 2 2.8,0
S64Y = drill 0.813 long: A 2.54,1.27; E -2.54,1.27; S 0,-1.27
M0805 = smd 1.3 x 1.6: 1 -0.95,0; 2 0.95,0
M1206 = smd 1.6 x 2: 1 -1.4,0; 2 1.4,0
R1206 = smd 1.6 x 1.803: 1 -1.422,0; 2 1.422,0
FE06 = drill 0.813 long: 1 -6.35,0; 2 -3.81,0; 3 -1.27,0; 4 1.27,0; 5 3.81,0; 6 6.35,0
FE10 = drill 0.813 long: 1 -11.43,0; 2 -8.89,0; 3 -6.35,0; 4 -3.81,0; 5 -1.27,0; 6 1.27,0; 7 3.81,0; 8 6.35,0; 9 8.89,0; 10 11.43,0
SOT89 = smd 0.8 x 1.4: 1 -1.499,-1.981; 3 1.499,-1.981 | smd 0.8 x 1.9: 2 0,-1.727 | smd 2.032 x 3.65: 2@1 0,0.94
SOT223 = smd 1.219 x 2.235: 1 -2.311,-3.099; 2 0,-3.099; 3 2.311,-3.099 | smd 3.6 x 2.2: 4 0,3.099
VSSOP-8 = smd 0.4 x 1: 1 -0.975,-2.15; 2 -0.325,-2.15; 3 0.325,-2.15; 4 0.975,-2.15; 5 0.975,2.15; 6 0.325,2.15; 7 -0.325,2.15; 8 -0.975,2.15
SOT65P210X110-6N = smd 1.168 x 0.356: 1 -1.041,0.66; 2 -1.041,0; 3 -1.041,-0.66; 4 1.041,-0.66; 5 1.041,0; 6 1.041,0.66
TQFP32-08 = smd 1.27 x 0.559: 1 -4.293,2.8; 2 -4.293,2; 3 -4.293,1.2; 4 -4.293,0.4; 5 -4.293,-0.4; 6 -4.293,-1.2; 7 -4.293,-2; 8 -4.293,-2.8; 17 4.293,-2.8; 18 4.293,-2; 19 4.293,-1.2; 20 4.293,-0.4; 21 4.293,0.4; 22 4.293,1.2; 23 4.293,2; 24 4.293,2.8 | smd 0.559 x 1.27: 9 -2.8,-4.293; 10 -2,-4.293; 11 -1.2,-4.293; 12 -0.4,-4.293; 13 0.4,-4.293; 14 1.2,-4.293; 15 2,-4.293; 16 2.8,-4.293; 25 2.8,4.293; 26 2,4.293; 27 1.2,4.293; 28 0.4,4.293; 29 -0.4,4.293; 30 -1.2,4.293; 31 -2,4.293; 32 -2.8,4.293
SOT95P280X145-6N = smd 1.27 x 0.559: 1 -1.295,0.94; 2 -1.295,0; 3 -1.295,-0.94; 4 1.295,-0.94; 5 1.295,0; 6 1.295,0.94
CR2032 = drill 1.5 pad 3: + 0,0; - 0,20.5
SC-70 = smd 0.36 x 0.95: 1 -0.65,-0.95; 2 0,-0.95; 3 0.65,-0.95; 4 0.65,0.95; 5 0,0.95; 6 -0.65,0.95
AK300/2 = drill 1.321 long: 1 -2.515,0; 2 2.489,0

### Placement (x,y rotation side)
BSC600N25NS  123,14 0 top
C1  115,14.65 0 top
C2  113.45,13.55 180 top
C3  118.95,5.1 270 top
C4  113.85,26.05 270 top
C5  116.25,26.05 270 top
C6  146.5,38 90 top
C7  147.75,46.6 90 top
C8  130.5,19 180 top
C9  135,19 180 top
C10  17.22,39.49 270 top
C11  142.8,10.1 270 top
C12  135.85,7.55 180 top
C13  128.9,8 270 top
C14  28.57,37.9 270 top
C15  19.15,24.8 0 top
C16  46.8,14.6 180 top
C17  25.75,13.3 270 bottom
C18  46.75,19.7 0 top
C19  61.2,16.15 270 top
C20  59,16.15 270 top
C21  63.1,16.15 270 top
C22  147,65.05 270 top
C23  147,58.37 90 top
C24  110.15,58.4 90 top
C25  110.15,65.05 270 top
C26  73.35,58.35 90 top
C27  73.35,65.05 270 top
C28  36.55,58.4 90 top
C29  36.55,65.05 270 top
C30  152.05,47.25 270 top
C31  152.85,43.45 0 top
C32  50.65,33.85 180 top
D1  126.5,16 0 top
D2  129,13 0 top
D3  131.5,16 0 top
D4  134,13 0 top
D5  136.5,16 0 top
D6  47.75,23.3 90 top
D7  45.75,23.3 90 top
EL7242  150.5,38 180 top
IC1  24.79,58.37 180 top
IC2  61.62,58.37 180 top
IC3  98.45,58.37 180 top
IC4  135.28,58.37 180 top
IC5  24.79,69.8 180 top
IC6  61.62,69.8 180 top
IC7  98.45,69.8 180 top
IC8  135.28,69.8 180 top
IC9  42.6,37.15 90 top
J1  2.9,29.25 90 top
J2  27.97,29.48 180 top
JP1  31.75,27.7 90 top
L1  123,23 0 top
L2  53.1,19.5 0 top
R1  116.55,13.55 0 top
R2  117.2,5.25 90 top
R3  112.5,7.75 180 top
R4  100k  [R0402']  146.2,47.25 0 top
R5  100k  [R0402']  153.6,46.6 180 top
R6  122.35,6.35 90 top
R7  103.45,33.3 180 top
R8  1k  [R0402']  146.2,45.95 0 top
R9  40.9,14.6 90 top
R10  138.5,28 90 top
R11  152,18.5 270 top
R12  154,20.5 90 top
R13  40.9,18.75 270 top
R14  8.92,79.33 90 top
R15  15.9,79.33 90 top
R16  22.89,79.33 90 top
R17  29.87,79.33 90 top
R18  36.86,79.33 90 top
R19  12.73,79.33 90 bottom
R20  19.71,79.33 90 bottom
R21  26.7,79.33 90 bottom
R22  33.68,79.33 90 bottom
R23  40.67,79.33 90 bottom
R24  45.75,79.33 90 top
R25  52.73,79.33 90 top
R26  59.72,79.33 90 top
R27  66.7,79.33 90 top
R28  73.69,79.33 90 top
R29  49.56,79.33 90 bottom
R30  56.54,79.33 90 bottom
R31  63.53,79.33 90 bottom
R32  70.51,79.33 90 bottom
R33  77.5,79.33 90 bottom
R34  82.58,79.33 90 top
R35  89.56,79.33 90 top
R36  96.55,79.33 90 top
R37  103.53,79.33 90 top
R38  110.52,79.33 90 top
R39  86.39,79.33 90 bottom
R40  93.37,79.33 90 bottom
R41  100.36,79.33 90 bottom
R42  107.34,79.33 90 bottom
R43  114.33,79.33 90 bottom
R44  119.41,79.33 90 top
R45  126.39,79.33 90 top
R46  133.38,79.33 90 top
R47  140.36,79.33 90 top
R48  147.35,79.33 90 top
R49  123.22,79.33 90 bottom
R50  130.2,79.33 90 bottom
R51  137.19,79.33 90 bottom
R52  144.17,79.33 90 bottom
R53  151.16,79.33 90 bottom
R54  136.5,28 90 top
R55  1k  [R0402']  153.6,47.9 180 top
R56  23.9,24.8 180 top
R57  119.85,35.25 0 top
R58  114.5,35.25 0 top
SV1  139.7,23.2 0 top
SV3  24.79,96.6 0 top
SV4  61.62,96.6 0 top
SV5  98.45,96.6 0 top
SV6  135.28,96.6 0 top
T1  148.55,18.45 180 top
T2  142.2,28 180 top
T3  147,28 0 top
T4  143.5,18.5 180 top
T5  154.5,27 180 top
T6  136.5,33 180 top
T7  10.82,86.31 0 top
T8  47.65,86.31 0 top
T9  84.48,86.31 0 top
T10  121.31,86.31 0 top
T11  17.81,86.31 0 top
T12  54.64,86.31 0 top
T13  91.47,86.31 0 top
T14  128.3,86.31 0 top
T15  24.79,86.31 0 top
T16  61.62,86.31 0 top
T17  98.45,86.31 0 top
T18  135.28,86.31 0 top
T19  31.78,86.31 0 top
T20  68.61,86.31 0 top
T21  105.44,86.31 0 top
T22  142.27,86.31 0 top
T23  38.76,86.31 0 top
T24  75.59,86.31 0 top
T25  112.42,86.31 0 top
T26  149.25,86.31 0 top
T27  10.82,86.31 0 bottom
T28  47.65,86.31 0 bottom
T29  84.48,86.31 0 bottom
T30  121.31,86.31 0 bottom
T31  17.81,86.31 0 bottom
T32  54.64,86.31 0 bottom
T33  91.47,86.31 0 bottom
T34  128.3,86.31 0 bottom
T35  24.79,86.31 0 bottom
T36  61.62,86.31 0 bottom
T37  98.45,86.31 0 bottom
T38  135.28,86.31 0 bottom
T39  31.78,86.31 0 bottom
T40  68.61,86.31 0 bottom
T41  105.44,86.31 0 bottom
T42  142.27,86.31 0 bottom
T43  38.76,86.31 0 bottom
T44  75.59,86.31 0 bottom
T45  112.42,86.31 0 bottom
T46  149.25,86.31 0 bottom
U1  116.9,9.9 180 top
U2  149.9,43.45 270 top
U4  22.89,38.69 180 top
U6  46.8,17.25 0 top
U$1  79.85,5.25 0 top
U$2  149.9,46.9 90 top
X1  22.75,13.3 270 top

### Tracks (layer width: path | path; a pad name or v marks a point on that pad's centre or on a via)
CLK_H1  (via drill 0.3)
  Top 0.305: U4.2 25.29,36.69 v25.05,36.45 | v18.45,42.9 17.15,44.2 17.15,58.65 18.45,59.94 IC1.7
  Bottom 0.305: v25.05,36.45 22.05,39.45 22.05,42.45 21.6,42.9 v18.45,42.9
CLK_H2
  Top 0.305: U4.9 25.69,43.89 26.05,44.25 49,44.25 49.75,45 49.75,57.75 50.4,58.4 54.8,58.4 55.35,58.95 55.35,62.11 IC2.7
CLK_M1  (via drill 0.3)
  Top 0.305: U4.10 24.89,44.39 25.9,45.4 47.75,45.4 48.35,46 v48.35,49 | v72.3,49 85.95,49 86.7,49.75 86.7,57.6 87.45,58.35 91.3,58.35 92.05,59.1 92.05,62.13 IC3.7
  Bottom 0.305: v48.35,49 v72.3,49
CLK_M2  (via drill 0.3)
  Top 0.305: U4.11 24.09,41.61 24.35,41.35 25.55,41.35 27.1,42.9 v68.6,42.9 | v72.35,42.9 122.4,42.9 123.05,43.55 123.05,57.75 123.85,58.55 128.45,58.55 128.95,59.05 128.95,62.17 IC4.7
  Bottom 0.305: v68.6,42.9 v72.35,42.9
D0  (via drill 0.3)
  Top 0.406: v139,48 139,54.56 IC4.14 | IC3.14 102.26,48 v102.25,48 | IC2.14 65.43,48 v65.4,48 | U4.12 23.29,44.29 v27,48
  Bottom 0.406: IC1.14 28.61,48 | 28.61,48 v65.4,48 v102.25,48 v139,48 | v27,48 28.61,48
D1  (via drill 0.3)
  Top 0.406: v136.5,47 136.5,54.56 IC4.13 | IC3.13 99.72,47 v99.7,47 | IC2.13 v62.9,47 | U4.13 22.49,44.99 v24.5,47
  Bottom 0.406: IC1.13 26.06,47 | 26.06,47 v62.9,47 v99.7,47 v136.5,47 | v24.5,47 26.06,47
D2  (via drill 0.3)
  Top 0.406: v134,46 IC4.12 | IC3.12 97.18,46 v97.2,46 | IC2.12 v60.35,46 | U4.14 21.69,45.69 v22,46
  Bottom 0.406: IC1.12 23.52,46 | 23.52,46 v60.35,46 v97.2,46 v134,46 | v22,46 23.52,46
GND  (via drill 0.3, 0.35, 0.4, 0.5, 0.6)
  Top 0.254: 150,46.25 149.9,46.35
  Top 0.305: v59.2,12.5 59,12.7 59,13.5 | U$2.4 149.8,47.55 149.9,47.45 v149.9,46.9 | U$2.1 150,46.25 | 149.9,46.35 v149.9,46.9 | U2.2 v149.9,46.9
  Top 0.406: C1.1 113.25,14.65 112.8,14.2 C2.2 v112.8,12.6 | 22.51,38.29 U4.21 17.78,38.29 C10.2 | 22.51,38.29 23.31,37.49 U4.3 28.34,37.49 C14.2 29.25,37.25 v29.5,37 | U4.5 23.31,39.09 22.51,38.29 | R2.1 117.2,4.25 117.3,4.15 C3.2 | v127.55,3.2 127.75,3.2 128.1,3.55 | U1.5 U1.4 115.92,11.88 115.4,11.35 | 115.4,11.35 115.4,8.45 | 115.4,8.45 115.8,8.05 115.8,11.25 115.7,11.35 115.4,11.35 | 115.4,11.35 115.35,11.3 | 115.35,11.3 115.15,11.1 | 115.15,11.1 115.15,8.95 | 115.15,8.95 115.15,8.7 | 115.15,8.7 115.4,8.45 | 115.15,8.7 114.95,8.9 114.95,10.9 115.15,11.1 | 115.35,11.3 115.35,11.25 116.2,10.4 116.2,9.4 115.95,9.15 | v115.2,9 115.15,8.95 | IC9.13 39.69,36.52 v39.7,36.5
  Top 0.61: R9.1 42.4,13.65 43.27,14.53 | 43.27,14.53 43.35,14.6 | v43.1,14.6 43.2,14.6 43.27,14.53 | U6.2 46.55,17.25 46.85,16.95 46.85,16.05 C16.2 | T4.3 140.52,20.48 v140.5,20.5 | T6.3 v135,36.5 | T26.3 151.5,83.28 v151.5,85.5 | T22.3 144.5,83.3 v144.5,85.5 | T18.3 137.5,83.31 v137.5,85.5 | T14.3 130.5,83.33 v130.5,85.5 | T10.3 123.5,83.34 v123.5,85.5 | T25.3 114.5,83.45 v114.5,85.5 | T21.3 107.5,83.47 v107.5,85.5 | T17.3 100.5,83.48 v100.5,85.5 | T13.3 93.5,83.5 v93.5,85.5 | T9.3 86.5,83.51 v86.5,85.5 | T24.3 77.91,85.41 v78,85.5 | T20.3 71,83.29 v71,85.5 | T16.3 64,83.28 v64,85.5 | T12.3 56.95,85.45 v57,85.5 | T8.3 49.97,85.47 v50,85.5 | T23.3 41.08,85.42 v41,85.5 | T19.3 34,83.31 v34,85.5 | T15.3 27.11,85.39 v27,85.5 | T11.3 20.12,85.38 v20,85.5 | T7.3 13,83.35 v13,85.5 | EL7242.5 148.59,35.91 147.9,36.6 C6.1 146.4,36.5 | T3.3 148.5,24.55 v148.5,24.5 | T5.3 v153,30.2 | C32.1 v53,33.85
  Top 0.813: IC2.8 52.73,63.45 51.47,64.72 51.47,67.26 52.73,68.53 IC6.8 | IC1.8 15.9,63.45 14.63,64.72 14.63,67.26 15.9,68.53 IC5.8 | IC3.8 89.56,63.45 88.29,64.72 88.29,67.26 89.56,68.53 IC7.8 | IC4.8 126.39,63.45 125.12,64.72 125.12,67.26 126.39,68.53 IC8.8 | C23.2 v147,62.15 C22.2 | C28.2 v36.55,62.15 C29.2 | C24.2 v110.15,62.15 C25.2 | C26.2 v73.35,62.15 C27.2 | D6.A v47.75,26.45 | C4.2 113.4,24.2 v113.4,22.45 v116.7,22.45 116.7,24.3 116.05,23.65 114,23.65 113.95,23.6 113.95,22.9 114.15,23.1 116.2,23.1
  Top 1.016: C3.2 118.95,3.7 119.1,3.55 R6.1 | C21.2 63.1,14.7 62.75,14.35 61.6,14.35 C19.2 | C31.2 v155.1,43.45 | C6.1 v144.95,36.6
  Top 1.6: C5.2 C4.2 | R6.1 128.1,3.55 129,4.45 C13.2 | C19.2 61.2,12.85 59,12.85 59,13.5 C20.2 | C16.2 43.35,14.6
  Bottom 0.406: v112.8,12.6 112.8,12.5 | v29.5,37 30.5,37
  Bottom 0.61: v135,36.5 135,36
  Bottom 0.813: IC5.8 15.9,79.33 15.5,79.73 T31.3 | IC6.8 52.73,79.33 52.33,79.73 T32.3 | IC7.8 89.56,79.33 89.16,79.73 T33.3 | IC8.8 126.39,79.33 125.99,79.73 T34.3 | v147,62.15 144.21,62.15 IC4.1 | v36.55,62.15 33.72,62.15 IC1.1 | v110.15,62.15 107.38,62.15 IC3.1 | v73.35,62.15 70.55,62.15 IC2.1 | v47.75,26.45 47.75,26.6
  other vias: 124.75,3.9 125.55,3.9 126.35,3.9 127.15,3.9 125.15,3.2 125.95,3.2 126.75,3.2 58.75,13.25 59.65,13.25 60.55,13.25 61.45,13.25 61,12.5 60.1,12.5 43.8,15 43.8,14.2 115.2,10.8 115.9,10.35 115.9,9.45 115.2,9.9 113.8,23.15 114.65,23.15 115.5,23.15 116.3,23.15 114.2,22.45 115.05,22.45 115.9,22.45
  pour Bottom (isolate 0.3): 0,0 160,0 160,100 0,100
H1_1
  Top 0.813: R14.2 8.51,80.73 T7.1
H1_2
  Top 0.813: R15.2 15.5,80.73 T11.1
H1_3
  Top 0.813: R16.2 22.48,80.73 T15.1
H1_4
  Top 0.813: R17.2 29.47,80.73 T19.1
H1_5
  Top 0.813: R18.2 36.45,80.73 T23.1
H1_6
  Bottom 0.813: R19.2 13.14,80.73 T27.1
H1_7
  Bottom 0.813: R20.2 20.12,80.73 T31.1
H1_8
  Bottom 0.813: R21.2 27.11,80.73 T35.1
H1_9
  Bottom 0.813: R22.2 34.09,80.73 T39.1
H1_10
  Bottom 0.813: R23.2 41.08,80.73 T43.1
H2_1
  Top 0.813: T8.1 45.34,80.73 R24.2
H2_2
  Top 0.813: T12.1 52.33,80.73 R25.2
H2_3
  Top 0.813: T16.1 59.31,80.73 R26.2
H2_4
  Top 0.813: T20.1 66.3,80.73 R27.2
H2_5
  Top 0.813: T24.1 73.28,80.73 R28.2
H2_6
  Bottom 0.813: T28.1 49.97,80.73 R29.2
H2_7
  Bottom 0.813: T32.1 56.95,80.73 R30.2
H2_8
  Bottom 0.813: T36.1 63.94,80.73 R31.2
H2_9
  Bottom 0.813: T40.1 70.92,80.73 R32.2
H2_10
  Bottom 0.813: T44.1 77.91,80.73 R33.2
INC
  Top 0.406: U4.1 30.44,35.89 31.5,34.85 31.75,34.6 JP1.3
IND1
  Top 0.61: T3.2 147,25 146,24 146,23.25 | 146,22.5 146,22.7 | 146,22.7 146,23.25 | SV1.6 146,23.25 | T1.2 148.55,21.55 147.85,22.25 146.45,22.25 146,22.7
IND2
  Top 0.61: T4.2 143.5,23.13 143.51,23.14 SV1.5 | SV1.5 143.51,23.26 143.5,23.27 | SV1.5 143.51,24.84 142.25,26.1 142.25,29.68 T2.2
  Bottom 0.61: SV1.5 143.55,23.24 143.55,23.75
M1_1
  Top 0.813: T9.1 82.17,81.14 R34.2
M1_2
  Top 0.813: T13.1 89.16,81.14 R35.2
M1_3
  Top 0.813: T17.1 96.14,81.14 R36.2
M1_4
  Top 0.813: T21.1 103.13,81.14 R37.2
M1_5
  Top 0.813: T25.1 110.11,81.14 R38.2
M1_6
  Bottom 0.813: T29.1 86.8,81.14 R39.2
M1_7
  Bottom 0.813: T33.1 93.78,81.14 R40.2
M1_8
  Bottom 0.813: T37.1 100.77,81.14 R41.2
M1_9
  Bottom 0.813: T41.1 107.75,81.14 R42.2
M1_10
  Bottom 0.813: T45.1 114.74,81.14 R43.2
M2_1
  Top 0.813: T10.1 119,81.14 R44.2
M2_2
  Top 0.813: T14.1 125.99,81.14 R45.2
M2_3
  Top 0.813: T18.1 132.97,81.14 R46.2
M2_4
  Top 0.813: T22.1 139.96,81.14 R47.2
M2_5
  Top 0.813: T26.1 146.94,81.14 R48.2
M2_6
  Bottom 0.813: T30.1 123.63,81.14 R49.2
M2_7
  Bottom 0.813: T34.1 130.61,81.14 R50.2
M2_8
  Bottom 0.813: T38.1 137.6,81.14 R51.2
M2_9
  Bottom 0.813: T42.1 144.58,81.14 R52.2
M2_10
  Bottom 0.813: T46.1 151.57,81.14 R53.2
MISO  (via drill 0.3)
  Top 0.3: U4.16 20.09,41.76
  Top 0.406: 20.09,41.76 v20.1,41.75
  Bottom 0.3: v20.1,41.75 20.1,37.55 20.6,37.05 20.6,36.4 17.81,33.61 J2.9
MOSI  (via drill 0.3)
  Top 0.3: U4.15 20.89,41.81
  Top 0.406: U4.15 20.89,44.91 v20.98,45 | v131.5,45 131.5,54.54 IC4.11 | IC3.11 v94.64,45 v94.65,45 | IC2.11 57.81,45 v57.8,45 | 20.89,41.81 v20.95,41.75
  Bottom 0.3: v20.95,41.75 20.95,37.75 21.3,37.4 21.3,35.95 19.1,33.75 19.1,28.65 19.55,28.2 26.69,28.2 J2.1
  Bottom 0.406: IC1.11 v20.98,45 v57.8,45 v94.65,45 v131.5,45
N$1  (via drill 0.35)
  Top 0.508: v44.9,35.25 42.24,35.24 IC9.14
  Bottom 0.508: U$1.+ 72.45,12.6 72.5,31.9 69.15,35.25 v44.9,35.25
N$2
  Top 0.61: R12.1 152.1,19.55 R11.1 151.02,20.43 T1.1
N$4
  Top 1.016: R58.1 105.9,35.25 | 105.9,35.25 104.13,35.25 R7.S | R7.E 105.99,35.16 105.9,35.25
N$9
  Bottom 0.813: IC1.3 28.61,63.45 27.97,64.09 19.08,64.09 18.45,64.72 IC5.10
N$10
  Top 0.813: IC1.6 IC5.11
N$11
  Top 0.813: IC1.5 IC5.12
N$12
  Top 0.813: IC1.4 IC5.13
N$13
  Bottom 0.813: IC2.3 65.43,63.45 64.8,64.09 55.91,64.09 55.27,64.72 IC6.10
N$14
  Top 0.813: IC2.6 IC6.11
N$15
  Top 0.813: IC2.5 IC6.12
N$16
  Top 0.813: IC2.4 IC6.13
N$17
  Bottom 0.813: IC3.3 102.26,63.45 101.63,64.09 92.74,64.09 92.11,64.72 IC7.10
N$18
  Top 0.813: IC3.6 IC7.11
N$19
  Top 0.813: IC7.12 IC3.5
N$20
  Top 0.813: IC7.13 IC3.4
N$21
  Bottom 0.813: IC4.3 139.09,63.45 138.46,64.09 129.57,64.09 128.94,64.72 IC8.10
N$22
  Top 0.813: IC4.6 IC8.11
N$23
  Top 0.813: IC4.5 IC8.12
N$24
  Top 0.813: IC4.4 IC8.13
N$25  (1 unrouted)
  Top 0.813: T7.4 10.82,92.03 13.36,94.57 SV3.1
N$26  (1 unrouted)
  Top 0.813: T11.4 17.81,92.66 15.9,94.57 SV3.2
N$27
  Top 0.61: U6.1 46.04,18.19 46.15,18.3 46.15,19.3 C18.1 D7.C
N$28  (1 unrouted)
  Top 0.813: T15.4 24.79,91.39 24.16,92.03 20.98,92.03 18.45,94.57 SV3.3
N$29  (1 unrouted)
  Top 0.813: T19.4 31.78,92.66 31.14,93.3 22.25,93.3 20.98,94.57 SV3.4
N$30  (1 unrouted)
  Top 0.813: T23.4 38.76,92.03 36.22,94.57 24.16,94.57 23.52,95.2 SV3.5
N$31  (1 unrouted)
  Bottom 0.813: T27.4 10.82,92.03 13.36,94.57 25.43,94.57 26.06,95.2 SV3.6
N$32  (1 unrouted)
  Bottom 0.813: T31.4 17.81,92.66 18.45,93.3 27.33,93.3 28.61,94.57 SV3.7
N$33  (1 unrouted)
  Bottom 0.813: T35.4 24.79,91.39 25.43,92.03 28.61,92.03 31.14,94.57 SV3.8
N$34  (1 unrouted)
  Bottom 0.813: T39.4 31.78,92.66 33.68,94.57 SV3.9
N$35  (1 unrouted)
  Bottom 0.813: T43.4 38.76,92.03 36.22,94.57 SV3.10
N$36  (via drill 0.5)
  Top 0.406: U1.8 117.88,7.22 118.05,7.05 118.8,7.05 118.95,6.9 118.95,6.55 C3.1
  Top 0.813: R3.1 v114.8,7.75 | v118.95,7.75 118.95,6.55
  Bottom 0.813: v114.8,7.75 v118.95,7.75
N$37  (via drill 0.6)
  Top 0.813: R14.1 v8.92,69.8 | IC5.3 28.61,70.44 27.97,69.8 v18.45,69.8
  Bottom 0.813: v8.92,69.8 v18.45,69.8
N$38
  Top 0.813: IC5.14 28.61,67.9 27.97,68.53 17.81,68.53 17.17,69.17 17.17,75.52 15.9,76.79 R15.1
N$39  (via drill 0.6)
  Top 0.813: R16.1 22.89,75.52 22.25,74.88 22.25,71.71 22.89,71.07 v27.33,71.07
  Bottom 0.813: v27.33,71.07 30.51,71.07 31.14,71.71 IC5.2
N$40
  Top 0.813: R17.1 29.88,69.17 31.14,67.9 IC5.15
N$41
  Top 0.813: R18.1 36.86,76.15 36.22,75.52 34.32,75.52 33.68,74.88 IC5.1
N$42
  Bottom 0.813: R19.1 12.73,71.71 13.36,71.07 20.35,71.07 20.98,71.71 IC5.6
N$43
  Bottom 0.813: R20.1 19.71,76.79 18.45,75.52 IC5.7
N$44
  Bottom 0.813: R21.1 26.7,75.52 26.06,74.88 IC5.4
N$45  (via drill 0.6)
  Top 0.813: v32.41,68.53 v32.41,71.07
  Bottom 0.813: IC5.9 15.9,67.9 16.54,68.53 v32.41,68.53 | v32.41,71.07 32.41,75.52 33.68,76.79 R22.1
N$46
  Bottom 0.813: IC5.5 23.52,70.44 24.16,69.8 40.03,69.8 40.67,70.44 R23.1
N$47  (via drill 0.6)
  Top 0.813: IC6.3 65.43,70.44 64.8,69.8 v55.27,69.8 | v45.75,69.8 R24.1
  Bottom 0.813: v55.27,69.8 v45.75,69.8
N$48
  Top 0.813: R25.1 52.73,76.79 54.01,75.52 54.01,69.17 54.64,68.53 64.8,68.53 65.43,67.9 IC6.14
N$49  (via drill 0.6)
  Top 0.813: R26.1 59.72,75.52 59.08,74.88 59.08,71.71 59.72,71.07 v64.17,71.07
  Bottom 0.813: v64.17,71.07 67.34,71.07 67.97,71.71 IC6.2
N$50
  Top 0.813: R27.1 66.7,69.17 67.97,67.9 IC6.15
N$51
  Top 0.813: IC6.1 70.51,74.88 71.15,75.52 73.06,75.52 73.69,76.15 R28.1
N$52
  Bottom 0.813: R29.1 49.56,71.71 50.19,71.07 57.18,71.07 57.81,71.71 IC6.6
N$53
  Bottom 0.813: IC6.7 55.27,75.52 56.54,76.79 R30.1
N$54
  Bottom 0.813: IC6.4 62.9,74.88 63.53,75.52 R31.1
N$55  (via drill 0.6)
  Top 0.813: v69.25,71.07 v69.25,68.53
  Bottom 0.813: R32.1 70.51,76.79 69.25,75.52 v69.25,71.07 | v69.25,68.53 53.37,68.53 52.73,67.9 IC6.9
N$56
  Bottom 0.813: R33.1 77.5,70.44 76.86,69.8 60.99,69.8 60.35,70.44 IC6.5
N$57  (1 unrouted)
  Top 0.813: T8.4 47.65,92.03 50.19,94.57 SV4.1
N$58  (1 unrouted)
  Top 0.813: T12.4 54.64,92.66 52.73,94.57 SV4.2
N$59  (1 unrouted)
  Top 0.813: T16.4 61.62,91.39 60.99,92.03 57.81,92.03 55.27,94.57 SV4.3
N$60  (1 unrouted)
  Top 0.813: T20.4 68.61,92.66 67.97,93.3 59.08,93.3 57.81,94.57 SV4.4
N$61  (1 unrouted)
  Top 0.813: T24.4 75.59,92.03 73.06,94.57 60.99,94.57 60.35,95.2 SV4.5
N$62  (1 unrouted)
  Bottom 0.813: T28.4 47.65,92.03 50.19,94.57 62.26,94.57 62.9,95.2 SV4.6
N$63  (1 unrouted)
  Bottom 0.813: T32.4 54.64,92.66 55.27,93.3 64.17,93.3 65.43,94.57 SV4.7
N$64  (1 unrouted)
  Bottom 0.813: T36.4 61.62,91.39 62.26,92.03 65.43,92.03 67.97,94.57 SV4.8
N$65  (1 unrouted)
  Bottom 0.813: T40.4 68.61,92.66 70.51,94.57 SV4.9
N$66  (1 unrouted)
  Bottom 0.813: T44.4 75.59,92.03 73.06,94.57 SV4.10
N$67  (via drill 0.6)
  Top 0.813: R44.1 v119.41,69.8 | v128.94,69.8 138.46,69.8 139.09,70.44 IC8.3
  Bottom 0.813: v119.41,69.8 v128.94,69.8
N$68
  Top 0.813: IC8.14 139.09,67.9 138.46,68.53 128.3,68.53 127.67,69.17 127.67,75.52 126.39,76.79 R45.1
N$69  (via drill 0.6)
  Top 0.813: v137.82,71.07 133.38,71.07 132.74,71.71 132.74,74.88 133.38,75.52 R46.1
  Bottom 0.813: IC8.2 141.63,71.71 141,71.07 v137.82,71.07
N$70
  Top 0.813: R47.1 140.36,69.17 141.63,67.9 IC8.15
N$71
  Top 0.813: IC8.1 144.17,74.88 144.81,75.52 146.71,75.52 147.35,76.15 R48.1
N$72
  Bottom 0.813: R49.1 123.22,71.71 123.86,71.07 130.84,71.07 131.47,71.71 IC8.6
N$73
  Bottom 0.813: IC8.7 128.94,75.52 130.2,76.79 R50.1
N$74
  Bottom 0.813: IC8.4 136.55,74.88 137.19,75.52 R51.1
N$75  (via drill 0.6)
  Top 0.813: v142.91,68.53 v142.91,71.07
  Bottom 0.813: IC8.9 126.39,67.9 127.03,68.53 v142.91,68.53 | v142.91,71.07 142.91,75.52 144.17,76.79 R52.1
N$76
  Bottom 0.813: R53.1 151.16,70.44 150.52,69.8 134.65,69.8 134.01,70.44 IC8.5
N$77  (via drill 0.6)
  Top 0.813: R34.1 v82.58,69.8 | v92.11,69.8 101.63,69.8 102.26,70.44 IC7.3
  Bottom 0.813: v82.58,69.8 v92.11,69.8
N$78
  Top 0.813: R35.1 89.56,76.79 90.83,75.52 90.83,69.17 91.47,68.53 101.63,68.53 102.26,67.9 IC7.14
N$79  (via drill 0.6)
  Top 0.813: R36.1 96.55,75.52 95.92,74.88 95.92,71.71 96.55,71.07 v101,71.07
  Bottom 0.813: v101,71.07 104.17,71.07 104.81,71.71 IC7.2
N$80
  Top 0.813: IC7.15 104.81,67.9 103.53,69.17 R37.1
N$81
  Top 0.813: IC7.1 107.34,74.88 107.98,75.52 109.89,75.52 110.52,76.15 R38.1
N$82
  Bottom 0.813: R39.1 86.39,71.71 87.03,71.07 94.01,71.07 94.64,71.71 IC7.6
N$83
  Bottom 0.813: IC7.7 92.11,75.52 93.37,76.79 R40.1
N$84
  Bottom 0.813: IC7.4 99.72,74.88 100.36,75.52 R41.1
N$85  (via drill 0.6)
  Top 0.813: v106.08,71.07 v106.08,68.53
  Bottom 0.813: R42.1 107.34,76.79 106.08,75.52 v106.08,71.07 | v106.08,68.53 90.2,68.53 89.56,67.9 IC7.9
N$86
  Bottom 0.813: R43.1 114.33,70.44 113.69,69.8 97.82,69.8 97.18,70.44 IC7.5
N$89
  Top 0.61: U6.3 44.54,16.31 44.19,16.66 40.9,16.65 | 40.9,16.65 R13.2 | R9.2 40.9,16.65
N$90
  Top 0.406: L1.2 124.9,18.55 125,18.45 125,16.75 124.95,16.7 123.5,16.7 121,16.7 121,18.4 121.15,18.55 L1.2 | L1.2 121.6,18.55 121.35,18.3 121.35,17.4 121.25,17.3 124.75,17.3 124.8,17.25 124.8,18.15 124.6,18.35 122.3,18.35 121.55,17.6 123.95,17.6 | 124.6,17.6 123.95,17.6 | 123.95,17.6 123.05,18.5 123.05,15 BSC600N25NS.DRAIN
  Top 1.016: 123.5,16.7 124.2,16 D1.A 126.5,18 127.5,19 C8.2
N$91
  Top 0.406: U1.7 117.22,5.92 R2.2
N$92
  Top 0.406: U1.6 116.58,8.68 116.9,9 119.65,9 120,8.65 120,7.65 120.35,7.3 124.5,7.3 124.91,7.71 BSC600N25NS.GATE
N$93
  Top 0.406: BSC600N25NS.SOURCE3 123.64,11.55 121.1,11.55 BSC600N25NS.SOURCE BSC600N25NS.SOURCE1 | BSC600N25NS.SOURCE1 BSC600N25NS.SOURCE3 123.65,9.9 123.45,9.9 | 121.45,9.9 121.1,9.9 121.1,10.85 123.45,10.85 123.45,9.9 | 123.45,9.9 121.45,9.9 | 121.45,9.9 121.45,10.8 123.15,10.8 123.15,9.95 121.75,9.95 121.75,10.75 122.85,10.75 122.85,10.05 122.1,10.05 122.1,10.65 122.6,10.65 122.6,10.15 122.35,10.15 122.35,10.6 122.36,10.6 BSC600N25NS.SOURCE1 | BSC600N25NS.SOURCE1 R6.2 122.2,9 120.75,9 120,9.75 118.5,9.75 117.88,10.38 U1.1
N$94
  Top 1.016: C9.2 C8.1 131.5,18.95 D3.A 131.5,13.12 D2.K
N$95
  Top 1.016: D4.K 136.5,13.12 D5.A 136.5,18.45 C9.1
N$96
  Top 1.016: D1.K 129,15.88 D2.A 129,10.65 C13.1 132,10.55 133.25,9.3 133.25,8.35 C12.2
N$97  (1 unrouted)
  Top 0.813: T9.4 84.48,92.03 87.03,94.57 SV5.1
N$98  (1 unrouted)
  Top 0.813: T13.4 91.47,92.66 89.56,94.57 SV5.2
N$99  (1 unrouted)
  Top 0.813: T17.4 98.45,91.39 97.82,92.03 94.64,92.03 92.11,94.57 SV5.3
N$100  (1 unrouted)
  Top 0.813: T21.4 105.44,92.66 104.81,93.3 95.92,93.3 94.64,94.57 SV5.4
N$101  (1 unrouted)
  Top 0.813: T25.4 112.42,92.03 109.89,94.57 97.82,94.57 97.18,95.2 SV5.5
N$102  (1 unrouted)
  Bottom 0.813: T29.4 84.48,92.03 87.03,94.57 99.09,94.57 99.72,95.2 SV5.6
N$103  (1 unrouted)
  Bottom 0.813: T33.4 91.47,92.66 92.11,93.3 101,93.3 102.26,94.57 SV5.7
N$104  (1 unrouted)
  Bottom 0.813: T37.4 98.45,91.39 99.09,92.03 102.26,92.03 104.81,94.57 SV5.8
N$105  (1 unrouted)
  Bottom 0.813: T41.4 105.44,92.66 107.34,94.57 SV5.9
N$106  (1 unrouted)
  Bottom 0.813: T45.4 112.42,92.03 109.89,94.57 SV5.10
N$107  (1 unrouted)
  Top 0.813: T10.4 121.31,92.03 123.86,94.57 SV6.1
N$108  (1 unrouted)
  Top 0.813: T14.4 128.3,92.66 126.39,94.57 SV6.2
N$109  (1 unrouted)
  Top 0.813: T18.4 135.28,91.39 134.65,92.03 131.47,92.03 128.94,94.57 SV6.3
N$110  (1 unrouted)
  Top 0.813: T22.4 142.27,92.66 141.63,93.3 132.74,93.3 131.47,94.57 SV6.4
N$111  (1 unrouted)
  Top 0.813: T26.4 149.25,92.03 146.71,94.57 134.65,94.57 134.01,95.2 SV6.5
N$112  (1 unrouted)
  Bottom 0.813: T30.4 121.31,92.03 123.86,94.57 135.92,94.57 136.55,95.2 SV6.6
N$113  (1 unrouted)
  Bottom 0.813: T34.4 128.3,92.66 128.94,93.3 137.82,93.3 139.09,94.57 SV6.7
N$114  (1 unrouted)
  Bottom 0.813: T38.4 135.28,91.39 135.92,92.03 139.09,92.03 141.63,94.57 SV6.8
N$115  (1 unrouted)
  Bottom 0.813: T42.4 142.27,92.66 144.17,94.57 SV6.9
N$116  (1 unrouted)
  Bottom 0.813: T46.4 149.25,92.03 146.71,94.57 SV6.10
N$118
  Top 1.016: D3.K 134,15.88 D4.A 134,12.05 135.85,10.2 138.2,10.2 138.5,9.9 138.4,9.8 C12.1 C11.2
N$120
  Top 0.406: U1.2 117.22,13.53 R1.2 117.2,14.2 116.75,14.65 C1.2
N$121  (via drill 0.3, 0.35)
  Top 0.406: U1.3 116.58,11.07 v117.05,10.6 | v117.15,33.85 117.15,35.2 117.2,35.25
  Top 1.016: R57.1 117.2,35.25 R58.2
  Bottom 0.406: v117.05,10.6 117.05,13.95 116.3,14.7 113.5,14.7 111.65,16.55 111.65,30.2 115.3,33.85 v117.15,33.85
N$123
  Top 0.406: R1.1 C2.1
N$125
  Top 0.3: C15.1 17.35,24.8 16.3,25.85 16.3,27.05 14.1,29.25 J1.1
N$136  (via drill 0.35)
  Top 0.61: R54.1 138.45,27.05 | 138.45,27.05 R10.1 | T2.1 143.7,31.4 143.35,31.75 139.75,31.75 v139.55,31.55 | v138.5,25.6 138.5,27 138.45,27.05
  Bottom 0.61: v139.55,31.55 138.5,30.5 v138.5,25.6
N$137
  Top 0.61: T3.1 145.5,27 145,27.5 145,33 | T6.1 138,34 139,33 145,33 | EL7242.6 149.87,33.87 149,33 145,33
N$138
  Top 0.305: U$2.2 151.75,46.9 C30.2 R5.2
N$139
  Top 0.305: U$2.5 148.1,46.9 C7.2 R4.2
N$140
  Top 0.305: R8.2 C7.1 148.05,46.25 U$2.6 149.24,45.96 U2.3
N$141
  Top 0.61: R12.2 154,25.56 T5.2@1
N$142
  Top 0.61: R54.2 T6.2@1
N$143  (via drill 0.35)
  Top 0.305: R55.2 C30.1 151.7,47.55 U$2.3 v150.85,48.2 | U2.1 150.56,45.21 v150.85,45.55
  Bottom 0.305: v150.85,45.55 v150.85,48.2
N$145  (via drill 0.35)
  Top 0.61: T5.1 v156,32 154.95,33.05 151.95,33.05 151.13,33.87 EL7242.7 | T4.1 145.45,20.03 v145.45,16
  Bottom 0.61: v145.45,16 155,16 156,17 v156,32
N$148
  Top 0.61: 141,23.23 141,24 | T2.3 140.28,29.57 | 140.28,29.57 139.67,28.95 R10.2 | SV1.4 140.28,23.89 140.28,29.57 | R11.2 152,14.6 150,12.6 146.55,12.6 | 146.55,12.6 142.4,12.6 142.35,12.65 | T1.3 146.55,19.93 146.55,12.6
  Top 1.016: D5.K 140.4,16 | 140.4,16 140.4,17.6 138.43,19.57 SV1.3 | SV1.3 SV1.2 SV1.1 131.3,23.2 130.5,24 130.5,31.85 127.1,35.25 R57.2 | SV1.3 SV1.4 141,23.23 | 140.4,16 140.4,13 140.9,12.5 141.05,12.65 142.35,12.65 C11.1
N$150
  Top 0.305: U2.6 150.56,42.04 151.15,41.45 151.15,40.87 EL7242.2
N$151
  Top 0.305: U2.4 149.24,41.99 148.59,41.34 EL7242.4
NC  (2 unrouted)
RES
  Top 0.3: C15.2 21.6,24.8 21.6,28.19 J2.5 23.29,29.88 U4.29
  Top 0.305: 21.6,24.8 R56.2
RX  (via drill 0.3)
  Top 0.3: J1.3 15.07,34.33
  Top 0.305: v16.95,34.3 18.5,34.3 19.95,35.75 23.7,35.75 24.1,35.35 U4.30
  Top 0.406: 15.07,34.33 v15.1,34.3 | U4.30
  Bottom 0.3: v15.1,34.3 v16.95,34.3
SCK
  Top 0.3: U4.17 16.49,41.49 16,41 16,28.75 16.55,28.2 19.07,28.2 J2.7
SCL  (via drill 0.3, 0.35)
  Top 0.406: U4.28 22.5,34.38 v22.5,33 | v39.9,32.7 IC9.16
  Bottom 0.406: v39.9,32.7 39.6,33 v22.5,33
SDA  (via drill 0.3, 0.35)
  Top 0.406: U4.27 21.69,32.31 v22,32 | v41.05,33.95 41.02,33.98 IC9.15
  Bottom 0.406: v22,32 31.05,32 31.5,32 40.7,32 41.05,32.35 v41.05,33.95
SET
  Top 0.406: U4.32 25.69,32.16 26.05,31.8 28.75,31.8 30.15,30.4 30.15,28 30.45,27.7 JP1.2
SW
  Top 0.61: 49.9,19.7 L2.1
  Top 0.813: U6.6 48.79,18.19 L2.1
  Top 1.016: D6.C C18.2
  Top 1.27: C18.2 49.9,19.7
TX  (via drill 0.3)
  Top 0.3: J1.2 v15.09,31.79 | v16.85,31.8 18.25,31.8 19.05,31 v21.6,31
  Top 0.406: v15.09,31.79 v15.1,31.8 | v24.9,31 24.9,34.38 U4.31
  Bottom 0.3: v15.1,31.8 v16.85,31.8 | v21.6,31 v24.9,31
VCC
  Top 0.305: 145.7,49.9 R4.1 R8.1 145.7,44.8 147.5,43.45 149.9,43.45 | IC4.16 144.17,51.42 145.7,49.9 | 145.7,49.9 153.2,49.9 154.1,49 R55.1 R5.1 | U2.5 149.9,43.45 | C31.1 149.9,43.45 | 34.62,31.62 34.62,31.32 33.8,30.5 33.8,24.15 33.05,23.4 30.65,23.4 29.25,24.8 R56.1
  Top 0.406: U4.4 28.31,38.29 | 28.31,38.29 C14.1 28.55,38.58 28.55,39.55 28.21,39.89 U4.6 23.71,39.89 22.91,40.69 U4.18 18.59,40.7 17.45,40.7 17.22,40.47 C10.1 | 28.31,38.29 28.31,38.36 28.5,38.55 | D7.A 45.8,25.15 | IC9.2 45.48,33.98 45.25,33.75 45.25,31.12 45.3,31.07
  Top 0.61: R13.1 40.9,24.4 41.7,25.2 D7.A | D7.A 45.8,25.1 45.7,25.2 | D7.A 45.8,25.25 | 59,19 59,19.45 59.05,19.5 | IC9.2 49.58,33.98 C32.2
  Top 0.813: IC1.16 33.68,56.47 34.95,57.74 | 34.95,57.74 34.95,63.45 33.68,64.72 IC5.16 33.69,66 C29.1 | IC2.16 70.51,56.47 71.78,57.74 | 71.78,57.74 71.78,63.45 70.51,64.72 IC6.16 70.52,66 C27.1 | 108.61,57.74 107.34,56.47 IC3.16 | 108.61,57.74 108.61,63.45 107.34,64.72 IC7.16 C25.1 | C28.1 35.24,57.45 34.95,57.74 | C26.1 72.12,57.4 71.78,57.74 | C24.1 108.9,57.45 108.61,57.74 | C22.1 144.22,66 IC8.16 144.17,64.83 145.5,63.5 145.5,58 | IC4.16 144.17,56.67 145.5,58 | C23.1 146.08,57.42 145.5,58 | 45.8,25.15 45.8,31.07
  Top 1.016: 61.2,18.95 61.2,19.15 60.85,19.5 | C21.1 63.1,19.05 62.5,19.65 58.25,19.65 58.1,19.5 | L2.2 63,19.5 63.7,20.2 63.7,31.35 | 63.7,31.35 63.7,35.25 70.5,42.05 70.5,54.55 IC2.16 | 63.7,31.35 63.42,31.07 45.8,31.07 45.3,31.07 35.18,31.07 34.62,31.62 34.3,31.95 34.3,36.85 32.6,38.55 C14.1
  Top 1.27: L2.2 58.1,19.5 59.05,19.5 60.85,19.5
  Top 1.6: L2.2 56.12,19.48 | C19.1 61.2,18.95 | C20.1 59,19
  Bottom 1.27: IC1.16 33.68,53.52 34.75,52.45 70.47,52.5 | 70.47,52.5 107.34,52.45 | IC4.16 144.22,53.12 143.55,52.45 107.34,52.45 | 107.34,52.45 IC3.16 | 70.47,52.5 IC2.16
VCC/2
  Top 0.61: U6.5 48.85,17.25 49,17.1 49,16.3 | 49,16.3 49,14.15 48.85,14 48.8,14 C16.1 | U6.4 48.99,16.31 49,16.3 | C6.2 150,39.4 | 150,39.4 151.9,39.4 | EL7242.1 152.41,39.91 151.9,39.4 | EL7242.3 149.87,39.53 150,39.4 | EL7242.8 152.41,38.9 151.9,39.4
  Top 0.813: R3.2 110.85,7.75 108.38,10.22
  Top 1.016: C6.2 87.3,39.4 86.5,38.6 86.5,10.05 86.6,9.95
  Top 1.6: X1.1 33.23,15.81 34.95,14.1 34.95,11.55 36.55,9.95 48.4,9.95 | 48.4,9.95 86.6,9.95 108.1,9.95 108.38,10.22 110.2,12.05 110.2,26.15 111.5,27.45 C4.1 C5.1 L1.1 | C16.1 48.2,10.15 48.4,9.95
  Bottom 1.016: C17.1 25.75,15.12 25.05,15.81 X1.1
(copper drawn outside any net)
  shapes: Bottom circle x6, Top circle x6

### Text on the board
tPlace: FZT458 | GND | EL7242 | RX | TX | DTR | INC | SET | GND